# EAGLE design Vectr (EAGLE 6.3)

## Sheet 1 of 3: Analog
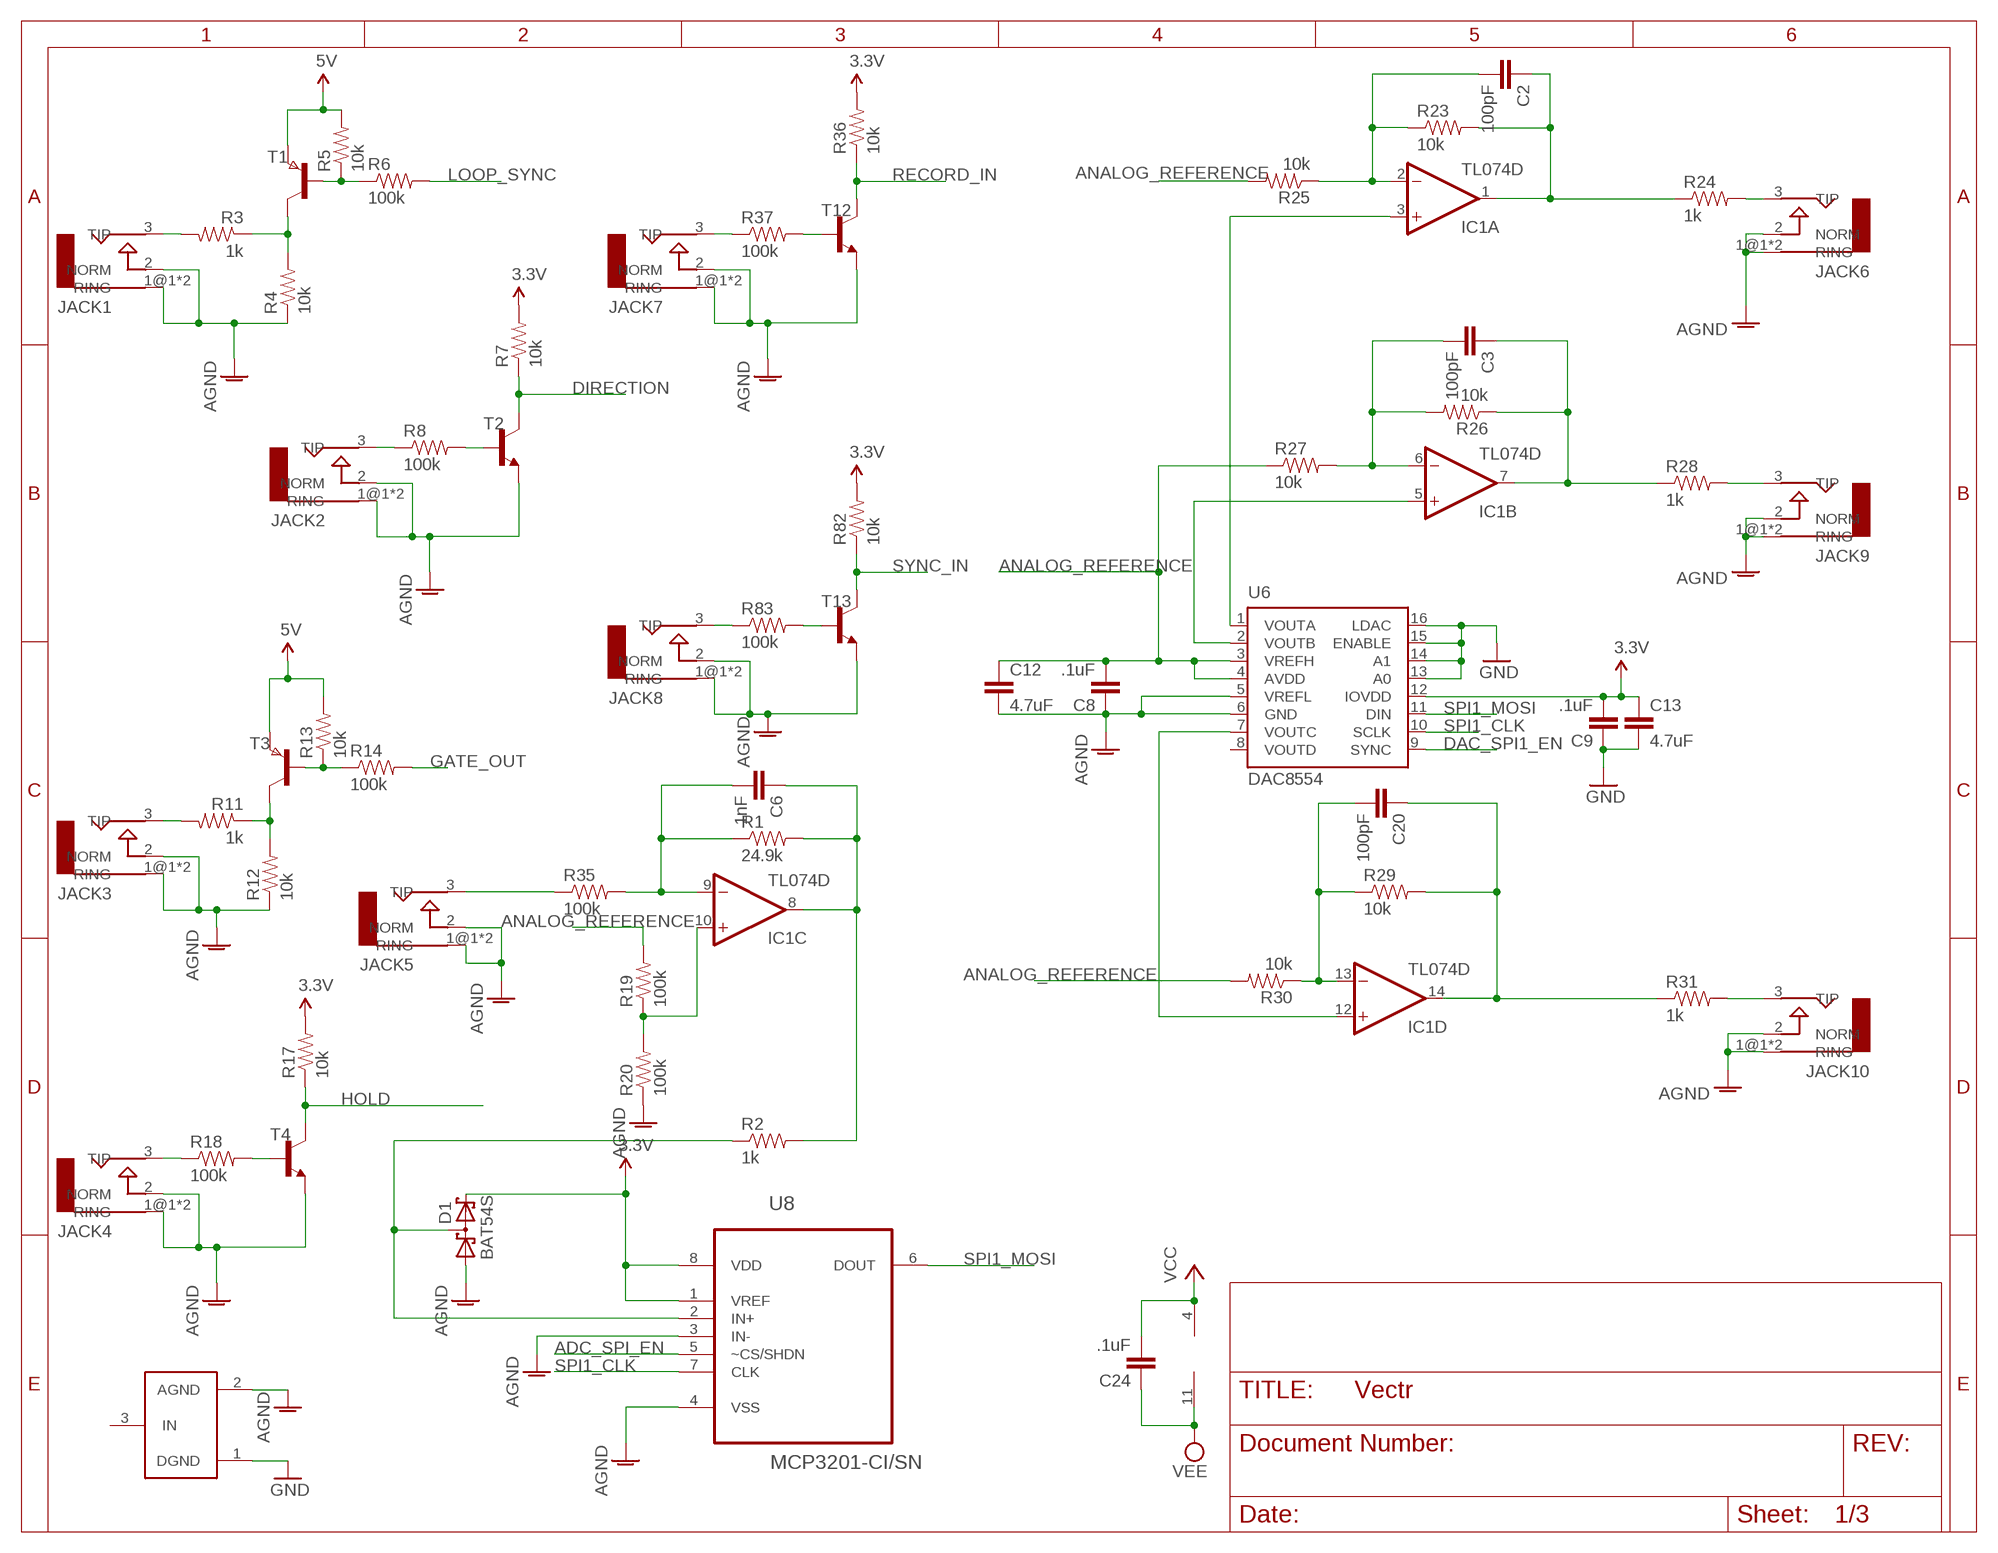
[diagram p0: schematic, sheet 1]

### Parts
C2  100pF  CAP0603-CAP  [0603-CAP]
C3  100pF  CAP0603-CAP  [0603-CAP]
C6  1nF  CAP0603-CAP  [0603-CAP]
C8  .1uF  CAP0603-CAP  [0603-CAP]
C9  .1uF  CAP0603-CAP  [0603-CAP]
C12  4.7uF  CAP1206  [1206]
C13  4.7uF  CAP1206  [1206]
C20  100pF  CAP0603-CAP  [0603-CAP]
C24  .1uF  CAP0603-CAP  [0603-CAP]
D1  BAT54S  [SOT23]
IC1  TL074D  [SO14]
JACK1  AUDIO-JACKERTHENVAR  [ERTHENVAR-JACK]
JACK2  AUDIO-JACKERTHENVAR  [ERTHENVAR-JACK]
JACK3  AUDIO-JACKERTHENVAR  [ERTHENVAR-JACK]
JACK4  AUDIO-JACKERTHENVAR  [ERTHENVAR-JACK]
JACK5  AUDIO-JACKERTHENVAR  [ERTHENVAR-JACK]
JACK6  AUDIO-JACKERTHENVAR  [ERTHENVAR-JACK]
JACK7  AUDIO-JACKERTHENVAR  [ERTHENVAR-JACK]
JACK8  AUDIO-JACKERTHENVAR  [ERTHENVAR-JACK]
JACK9  AUDIO-JACKERTHENVAR  [ERTHENVAR-JACK]
JACK10  AUDIO-JACKERTHENVAR  [ERTHENVAR-JACK]
R1  24.9k  RESISTOR0603-RES  [0603-RES]
R2  1k  RESISTOR0603-RES  [0603-RES]
R3  1k  RESISTOR0603-RES  [0603-RES]
R4  10k  RESISTOR0603-RES  [0603-RES]
R5  10k  RESISTOR0603-RES  [0603-RES]
R6  100k  RESISTOR0603-RES  [0603-RES]
R7  10k  RESISTOR0603-RES  [0603-RES]
R8  100k  RESISTOR0603-RES  [0603-RES]
R11  1k  RESISTOR0603-RES  [0603-RES]
R12  10k  RESISTOR0603-RES  [0603-RES]
R13  10k  RESISTOR0603-RES  [0603-RES]
R14  100k  RESISTOR0603-RES  [0603-RES]
R17  10k  RESISTOR0603-RES  [0603-RES]
R18  100k  RESISTOR0603-RES  [0603-RES]
R19  100k  RESISTOR0603-RES  [0603-RES]
R20  100k  RESISTOR0603-RES  [0603-RES]
R23  10k  RESISTOR0603-RES  [0603-RES]
R24  1k  RESISTOR0603-RES  [0603-RES]
R25  10k  RESISTOR0603-RES  [0603-RES]
R26  10k  RESISTOR0603-RES  [0603-RES]
R27  10k  RESISTOR0603-RES  [0603-RES]
R28  1k  RESISTOR0603-RES  [0603-RES]
R29  10k  RESISTOR0603-RES  [0603-RES]
R30  10k  RESISTOR0603-RES  [0603-RES]
R31  1k  RESISTOR0603-RES  [0603-RES]
R35  100k  RESISTOR0603-RES  [0603-RES]
R36  10k  RESISTOR0603-RES  [0603-RES]
R37  100k  RESISTOR0603-RES  [0603-RES]
R82  10k  RESISTOR0603-RES  [0603-RES]
R83  100k  RESISTOR0603-RES  [0603-RES]
T1  PNPSOT23  [SOT-23]
T2  -NPN-SOT23-EBC  [SOT23-EBC]
T3  PNPSOT23  [SOT-23]
T4  -NPN-SOT23-EBC  [SOT23-EBC]
T12  -NPN-SOT23-EBC  [SOT23-EBC]
T13  -NPN-SOT23-EBC  [SOT23-EBC]
U6  DAC8554  [PW_R-PDSO-G16]
U8  MCP3201-CI/SN  [SOIC127P600X175-8N]
U$11  GND_CONNECT  [GND_CONNECT]

### Nets
3.3V: C9.2 C13.1 D1.2(C2) R7.2 R17.2 R36.2 R82.2 U6.12(IOVDD) U8.1(VREF) U8.8(VDD) ; also sheet 2,3
5V: R5.2 R13.2 T1.2(E) T3.2(E) ; also sheet 2
ADC_SPI_EN: U8.5(~CS/SHDN) ; also sheet 3
AGND: C8.1 C12.2 D1.1(A1) JACK1.1@1(RING) JACK1.1@2(RING) JACK1.2(NORM) JACK2.1@1(RING) JACK2.1@2(RING) JACK2.2(NORM) JACK3.1@1(RING) JACK3.1@2(RING) JACK3.2(NORM) JACK4.1@1(RING) JACK4.1@2(RING) JACK4.2(NORM) JACK5.1@1(RING) JACK5.1@2(RING) JACK5.2(NORM) JACK6.1@1(RING) JACK6.1@2(RING) JACK6.2(NORM) JACK7.1@1(RING) JACK7.1@2(RING) JACK7.2(NORM) JACK8.1@1(RING) JACK8.1@2(RING) JACK8.2(NORM) JACK9.1@1(RING) JACK9.1@2(RING) JACK9.2(NORM) JACK10.1@1(RING) JACK10.1@2(RING) JACK10.2(NORM) R4.1 R12.1 R20.1 T2.E T4.E T12.E T13.E U6.5(VREFL) U6.6(GND) U8.3(IN-) U8.4(VSS) U$11.2(AGND) ; also sheet 2
ANALOG_REFERENCE: C8.2 C12.1 R19.2 R25.2 R27.1 R30.2 U6.3(VREFH) U6.4(AVDD) ; also sheet 2
DAC_SPI1_EN: U6.9(SYNC) ; also sheet 3
DIRECTION: R7.1 T2.C ; also sheet 3
GATE_OUT: R14.2 ; also sheet 3
GND: C9.1 C13.2 U6.13(A0) U6.14(A1) U6.15(ENABLE) U6.16(LDAC) U$11.1(DGND) ; also sheet 2,3
HOLD: R17.1 T4.C ; also sheet 3
LOOP_SYNC: R6.2 ; also sheet 3
N$1: R5.1 R6.1 T1.3(B)
N$2: C2.2 IC1.2(A:-IN) R23.1 R25.1
N$4: C2.1 IC1.1(A:OUT) R23.2 R24.1
N$5: R3.1 R4.2 T1.1(C)
N$6: JACK1.3(TIP) R3.2
N$7: IC1.5(B:+IN) U6.2(VOUTB)
N$8: JACK2.3(TIP) R8.1
N$9: R8.2 T2.B
N$11: C3.2 IC1.6(B:-IN) R26.2 R27.2
N$12: R13.1 R14.1 T3.3(B)
N$13: R11.1 R12.2 T3.1(C)
N$14: JACK3.3(TIP) R11.2
N$15: C3.1 IC1.7(B:OUT) R26.1 R28.1
N$16: R18.2 T4.B
N$18: JACK4.3(TIP) R18.1
N$19: C20.2 IC1.13(D:-IN) R29.1 R30.1
N$21: C20.1 IC1.14(D:OUT) R29.2 R31.1
N$22: C6.2 IC1.9(C:-IN) R1.1 R35.2
N$23: IC1.3(A:+IN) U6.1(VOUTA)
N$24: D1.3(C1A2) R2.1 U8.2(IN+)
N$25: JACK6.3(TIP) R24.2
N$26: JACK5.3(TIP) R35.1
N$27: C6.1 IC1.8(C:OUT) R1.2 R2.2
N$28: IC1.10(C:+IN) R19.1 R20.2
N$30: JACK7.3(TIP) R37.1
N$31: JACK9.3(TIP) R28.2
N$32: R37.2 T12.B
N$34: IC1.12(D:+IN) U6.7(VOUTC)
N$38: JACK10.3(TIP) R31.2
N$39: JACK8.3(TIP) R83.1
N$40: R83.2 T13.B
RECORD_IN: R36.1 T12.C ; also sheet 3
SPI1_CLK: U6.10(SCLK) U8.7(CLK) ; also sheet 3
SPI1_MOSI: U6.11(DIN) U8.6(DOUT) ; also sheet 3
SYNC_IN: R82.1 T13.C ; also sheet 3
VCC: C24.2 IC1.4(P:V+) ; also sheet 2
VEE: C24.1 IC1.11(P:V-) ; also sheet 2
Unconnected: U6.8(VOUTD) U$11.3(IN)

## Sheet 2 of 3: Power
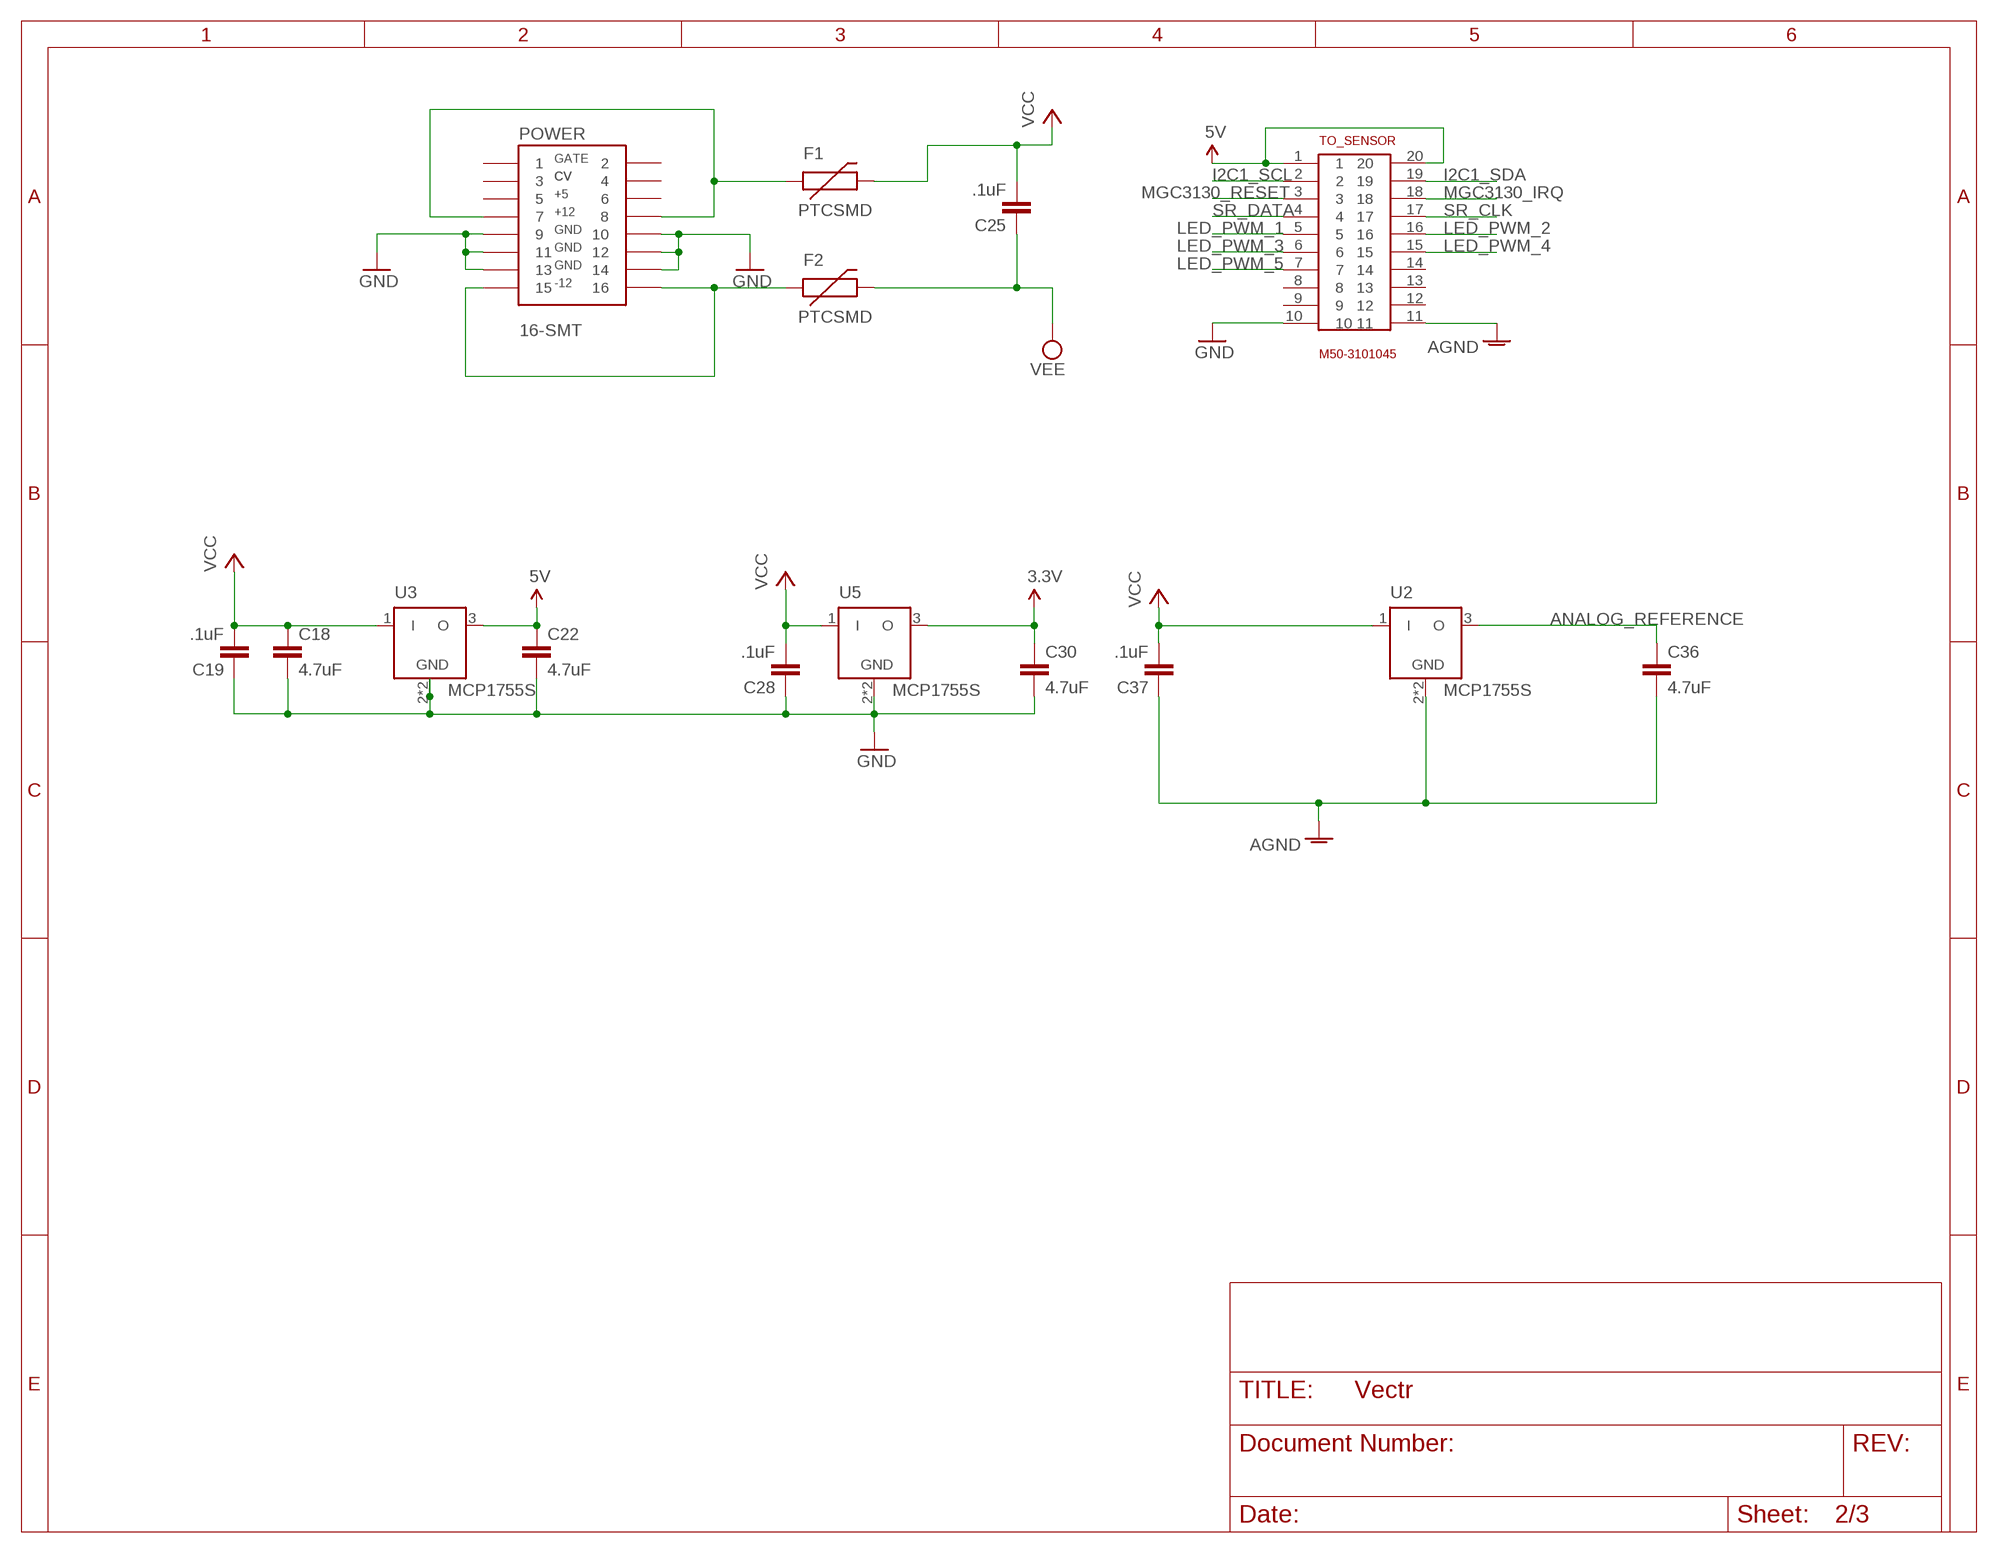
[diagram p1: schematic, sheet 2]

### Parts
C18  4.7uF  CAP1206  [1206]
C19  .1uF  CAP0603-CAP  [0603-CAP]
C22  4.7uF  CAP1206  [1206]
C25  .1uF  CAP0603-CAP  [0603-CAP]
C28  .1uF  CAP0603-CAP  [0603-CAP]
C30  4.7uF  CAP1206  [1206]
C36  4.7uF  CAP1206  [1206]
C37  .1uF  CAP0603-CAP  [0603-CAP]
F1  PTCSMD  [PTC-1206]
F2  PTCSMD  [PTC-1206]
POWER  16-SMT  [16-SMT]
TO_SENSOR  M50-3101045  [M50-3101045]
U2  MCP1755S  [SOT223]
U3  MCP1755S  [SOT223]
U5  MCP1755S  [SOT223]

### Nets
3.3V: C30.1 U5.3(O) ; also sheet 1,3
5V: C22.1 TO_SENSOR.1 TO_SENSOR.20 U3.3(O) ; also sheet 1
AGND: C36.2 C37.1 TO_SENSOR.11 U2.2(GND) U2.4(GND) ; also sheet 1
ANALOG_REFERENCE: C36.1 U2.3(O) ; also sheet 1
GND: C18.2 C19.1 C22.2 C28.1 C30.2 POWER.P$9 POWER.P$10 POWER.P$11 POWER.P$12 POWER.P$13 POWER.P$14 TO_SENSOR.10 U3.2(GND) U3.4(GND) U5.2(GND) U5.4(GND) ; also sheet 1,3
I2C1_SCL: TO_SENSOR.2 ; also sheet 3
I2C1_SDA: TO_SENSOR.19 ; also sheet 3
LED_PWM_1: TO_SENSOR.5 ; also sheet 3
LED_PWM_2: TO_SENSOR.16 ; also sheet 3
LED_PWM_3: TO_SENSOR.6 ; also sheet 3
LED_PWM_4: TO_SENSOR.15 ; also sheet 3
LED_PWM_5: TO_SENSOR.7 ; also sheet 3
MGC3130_IRQ: TO_SENSOR.18 ; also sheet 3
MGC3130_RESET: TO_SENSOR.3 ; also sheet 3
N$42: F1.1 POWER.P$7 POWER.P$8
N$44: F2.1 POWER.P$15 POWER.P$16
SR_CLK: TO_SENSOR.17 ; also sheet 3
SR_DATA: TO_SENSOR.4 ; also sheet 3
VCC: C18.1 C19.2 C25.2 C28.2 C37.2 F1.2 U2.1(I) U3.1(I) U5.1(I) ; also sheet 1
VEE: C25.1 F2.2 ; also sheet 1
Unconnected: POWER.P$1 POWER.P$2 POWER.P$3 POWER.P$4 POWER.P$5 POWER.P$6 TO_SENSOR.8 TO_SENSOR.9 TO_SENSOR.12 TO_SENSOR.13 TO_SENSOR.14

## Sheet 3 of 3: PIC32
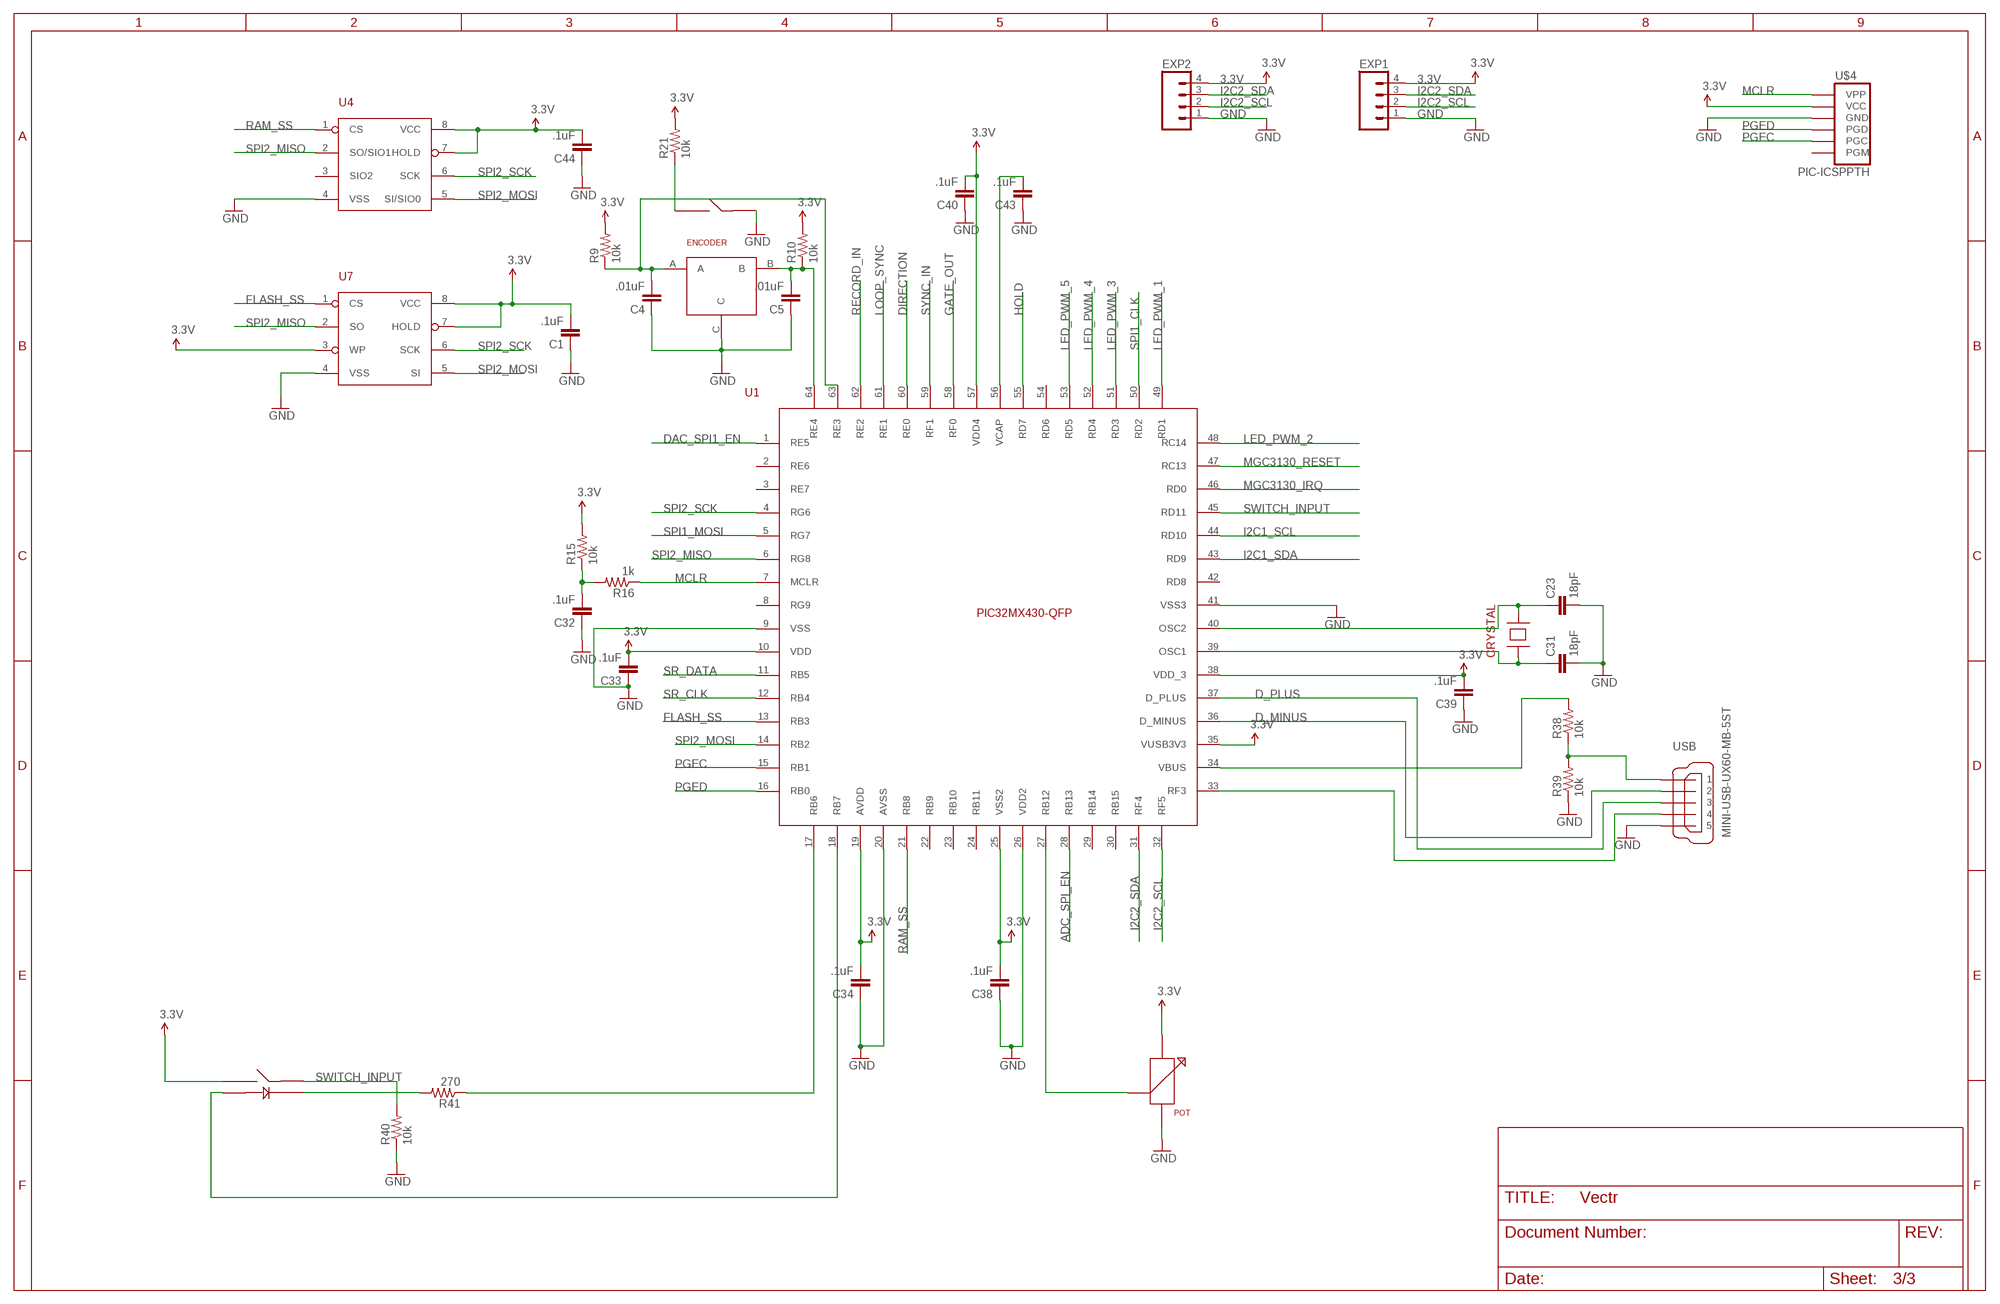
[diagram p2: schematic, sheet 3]

### Parts
C1  .1uF  CAP0603-CAP  [0603-CAP]
C4  .01uF  CAP0603-CAP  [0603-CAP]
C5  .01uF  CAP0603-CAP  [0603-CAP]
C23  18pF  CAP0603-CAP  [0603-CAP]
C31  18pF  CAP0603-CAP  [0603-CAP]
C32  .1uF  CAP0603-CAP  [0603-CAP]
C33  .1uF  CAP0603-CAP  [0603-CAP]
C34  .1uF  CAP0603-CAP  [0603-CAP]
C38  .1uF  CAP0603-CAP  [0603-CAP]
C39  .1uF  CAP0603-CAP  [0603-CAP]
C40  .1uF  CAP0603-CAP  [0603-CAP]
C43  .1uF  CAP0603-CAP  [0603-CAP]
C44  .1uF  CAP0603-CAP  [0603-CAP]
CRYSTAL  SMD-4-CRYSTAL  [SMD-4-CRYSTAL]
ENCODER  PEC16_ENCODER  [PEC16_ENCODER]
EXP1  M04SMD_STRAIGHT_COMBO  [1X04_SMD_STRAIGHT_COMBO]
EXP2  M04SMD_STRAIGHT_COMBO  [1X04_SMD_STRAIGHT_COMBO]
POT  9MMPOT  [9MMPOT]
R9  10k  RESISTOR0603-RES  [0603-RES]
R10  10k  RESISTOR0603-RES  [0603-RES]
R15  10k  RESISTOR0603-RES  [0603-RES]
R16  1k  RESISTOR0603-RES  [0603-RES]
R21  10k  RESISTOR0603-RES  [0603-RES]
R38  10k  RESISTOR0603-RES  [0603-RES]
R39  10k  RESISTOR0603-RES  [0603-RES]
R40  10k  RESISTOR0603-RES  [0603-RES]
R41  270  RESISTOR0603-RES  [0603-RES]
U1  PIC32MX430-QFP  [QFP50P1200X1200X120-64N]
U4  23LC512  [SO-08]
U7  SST25VF010A  [SO-08]
U$2  5GSH9  [5GSH9]
U$4  PIC-ICSPPTH  [MOLEX-1X6]
USB  MINI-USB-UX60-MB-5ST  [UX60-MB-5ST]

### Nets
3.3V: C1.2 C33.2 C34.2 C38.2 C39.2 C40.2 C44.2 EXP1.4 EXP2.4 POT.1 R9.2 R10.2 R15.2 R21.2 U1.10(VDD) U1.19(AVDD) U1.25(VSS2) U1.35(VUSB3V3) U1.38(VDD_3) U1.57(VDD4) U4.7(HOLD) U4.8(VCC) U7.3(WP) U7.7(HOLD) U7.8(VCC) U$2.1 U$4.5(VCC) ; also sheet 1,2
ADC_SPI_EN: U1.28(RB13) ; also sheet 1
D_MINUS: U1.36(D_MINUS) USB.2
D_PLUS: U1.37(D_PLUS) USB.3
DAC_SPI1_EN: U1.1(RE5) ; also sheet 1
DIRECTION: U1.60(RE0) ; also sheet 1
FLASH_SS: U1.13(RB3) U7.1(CS)
GATE_OUT: U1.58(RF0) ; also sheet 1
GND: C1.1 C4.1 C5.1 C23.2 C31.2 C32.1 C33.1 C34.1 C38.1 C39.1 C40.1 C43.1 C44.1 ENCODER.C ENCODER.E EXP1.1 EXP2.1 POT.3 R39.1 R40.1 U1.9(VSS) U1.20(AVSS) U1.26(VDD2) U1.41(VSS3) U4.4(VSS) U7.4(VSS) U$4.4(GND) USB.5 ; also sheet 1,2
HOLD: U1.55(RD7) ; also sheet 1
I2C1_SCL: U1.44(RD10) ; also sheet 2
I2C1_SDA: U1.43(RD9) ; also sheet 2
I2C2_SCL: EXP1.2 EXP2.2 U1.32(RF5)
I2C2_SDA: EXP1.3 EXP2.3 U1.31(RF4)
LED_PWM_1: U1.49(RD1) ; also sheet 2
LED_PWM_2: U1.48(RC14) ; also sheet 2
LED_PWM_3: U1.51(RD3) ; also sheet 2
LED_PWM_4: U1.52(RD4) ; also sheet 2
LED_PWM_5: U1.53(RD5) ; also sheet 2
LOOP_SYNC: U1.61(RE1) ; also sheet 1
MCLR: R16.1 U1.7(MCLR) U$4.6(VPP)
MGC3130_IRQ: U1.46(RD0) ; also sheet 2
MGC3130_RESET: U1.47(RC13) ; also sheet 2
N$17: C32.2 R15.1 R16.2
N$20: C5.2 ENCODER.B R10.1 U1.64(RE4)
N$29: C4.2 ENCODER.A R9.1 U1.63(RE3)
N$33: POT.2 U1.27(RB12)
N$35: U1.18(RB7) U$2.3
N$37: ENCODER.D R21.1
N$41: C23.1 CRYSTAL.3 U1.40(OSC2)
N$43: C31.1 CRYSTAL.1 U1.39(OSC1)
N$45: R38.1 R39.2 USB.1
N$46: C43.2 U1.56(VCAP)
N$47: R38.2 U1.34(VBUS)
N$50: U1.33(RF3) USB.4
N$51: R41.2 U$2.2
PGEC: U1.15(RB1) U$4.2(PGC)
PGED: U1.16(RB0) U$4.3(PGD)
RAM_SS: U1.21(RB8) U4.1(CS)
RECORD_IN: U1.62(RE2) ; also sheet 1
SPI1_CLK: U1.50(RD2) ; also sheet 1
SPI1_MOSI: U1.5(RG7) ; also sheet 1
SPI2_MISO: U1.6(RG8) U4.2(SO/SIO1) U7.2(SO)
SPI2_MOSI: U1.14(RB2) U4.5(SI/SIO0) U7.5(SI)
SPI2_SCK: U1.4(RG6) U4.6(SCK) U7.6(SCK)
SR_CLK: U1.12(RB4) ; also sheet 2
SR_DATA: U1.11(RB5) ; also sheet 2
SWITCH_INPUT: R40.2 U1.45(RD11) U$2.4
SWITCH_LED1: R41.1 U1.17(RB6)
SYNC_IN: U1.59(RF1) ; also sheet 1
Unconnected: U1.2(RE6) U1.3(RE7) U1.8(RG9) U1.22(RB9) U1.23(RB10) U1.24(RB11) U1.29(RB14) U1.30(RB15) U1.42(RD8) U1.54(RD6) U4.3(SIO2) U$4.1(PGM)

## Library data of the parts
C1-C6 C8 C9 C19 C20 C23-C25 C28 C31-C34 C37-C40 C43 C44 = SparkFun-Passives:CAP: Capacitor Standard 0603 ceramic capacitor, and 0.1" leaded capacitor.
C12 C13 C18 C22 C30 C36 = SparkFun-Capacitors:CAP: Capacitor Standard 0603 ceramic capacitor, and 0.1" leaded capacitor.
CRYSTAL = HackMe:SMD-4-CRYSTAL
D1 = diode:BAT54S: Schottky Diodes Pin connection corrected 2011-05-04 Source: Fairchild .. BAT54.pdf
ENCODER = HackMe:PEC16_ENCODER
EXP1 EXP2 = SparkFun-Connectors:M04: Header 4 Standard 4-pin 0.1" header. Use with straight break away headers (SKU : PRT-00116), right angle break away headers (PRT-00553), swiss pins (PRT-00743), machine pins (PRT-00117), and female headers (PRT-00115). Molex polarized connector foot print use with SKU : PRT-08231 with associated crimp pins and housings. 1MM SMD Version SKU: PRT-10208
F1 F2 = SparkFun-PowerIC:PTC: Resettable Fuse PTC Resettable Fuse. Spark Fun Electronics SKU : COM-08357
IC1 = linear:TL074: OP AMP
JACK1-JACK10 = erthenvar:AUDIO-JACK: Switching Mono 3.5mm Audio Jack from Erthenvar.
POT = HackMe:9MMPOT
POWER = HackMe:16-SMT
R1-R21 R23-R31 R35-R41 R82 R83 = SparkFun-Passives:RESISTOR: Resistor Basic schematic elements and footprints for 0603, 1206, and PTH resistors.
T1 T3 = zetex:PNPSOT23: PNP TRANSISTOR; MPN: DSS20200L-7; OC_FARNELL: unknown; OC_NEWARK: 25R4554
T2 T4 T12 T13 = transistor:*-NPN-: NPN Transistror BF959 corrected 2008.03.06
TO_SENSOR = HackMe:M50-3101045
U1 = HackMe:PIC32MX430-QFP
U2 U3 U5 = HackMe:MCP1755S
U4 = HackMe:23LC512: SPI SRAM 512kbit
U6 = HackMe:DAC8554: 16 bit 4 channel DAC
U7 = HackMe:SST25VF010A
U8 = Microchip_By_element14_Batch_1:MCP3201-CI/SN: 12Bit A/D Converter; MPN: MCP3201-CI/SN; OC_FARNELL: 3167240; OC_NEWARK: 73K1001; PACKAGE: SOIC-8; SUPPLIER: Microchip
U$2 = HackMe:5GSH9
U$4 = SparkFun-Connectors:PIC-ICSP: ISCP Programming connector for UAV, UBW Kit, etc.
U$11 = SparkFun-Passives:GND_CONNECT: Use to make a connection of multiple grounds in only one place.
USB = con-hirose:MINI-USB-: MINI USB Connector Source: http://www.hirose.co.jp/cataloge_hp/e24000019.pdf; OC_FARNELL: unknown; OC_NEWARK: unknown

## Board
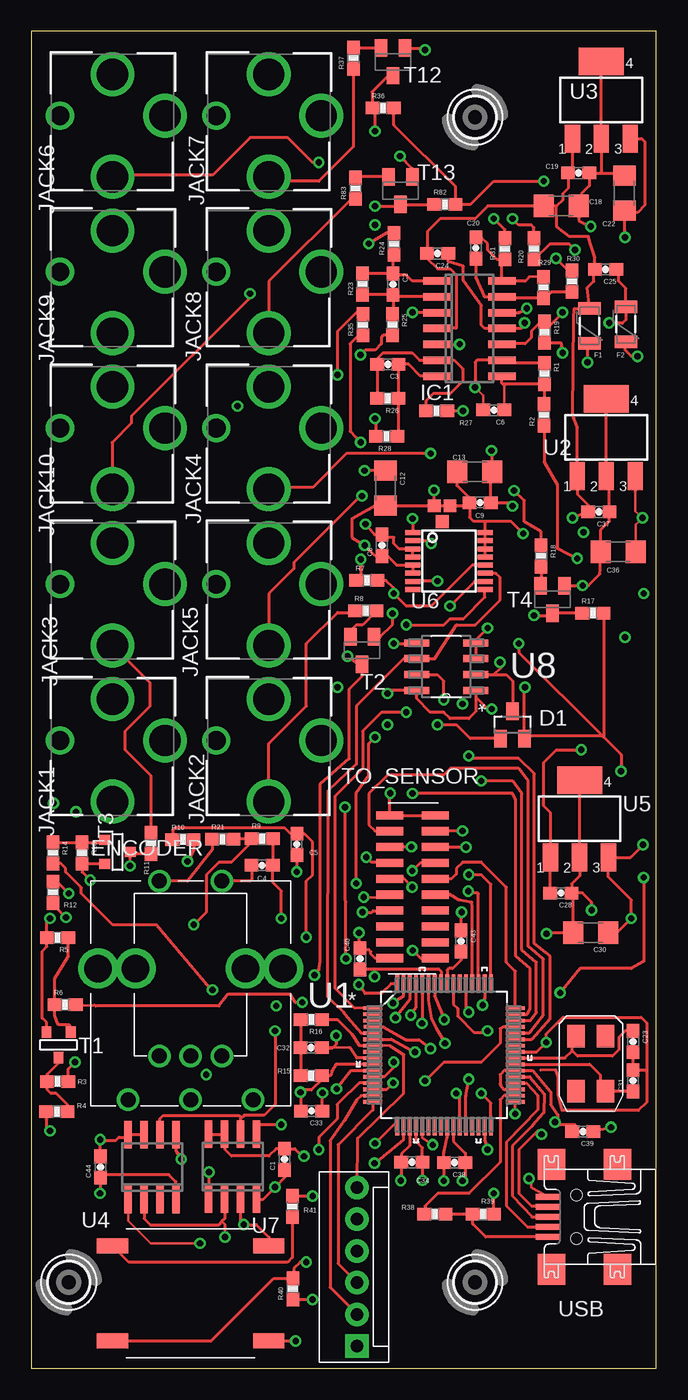
[diagram p3: board, top side]
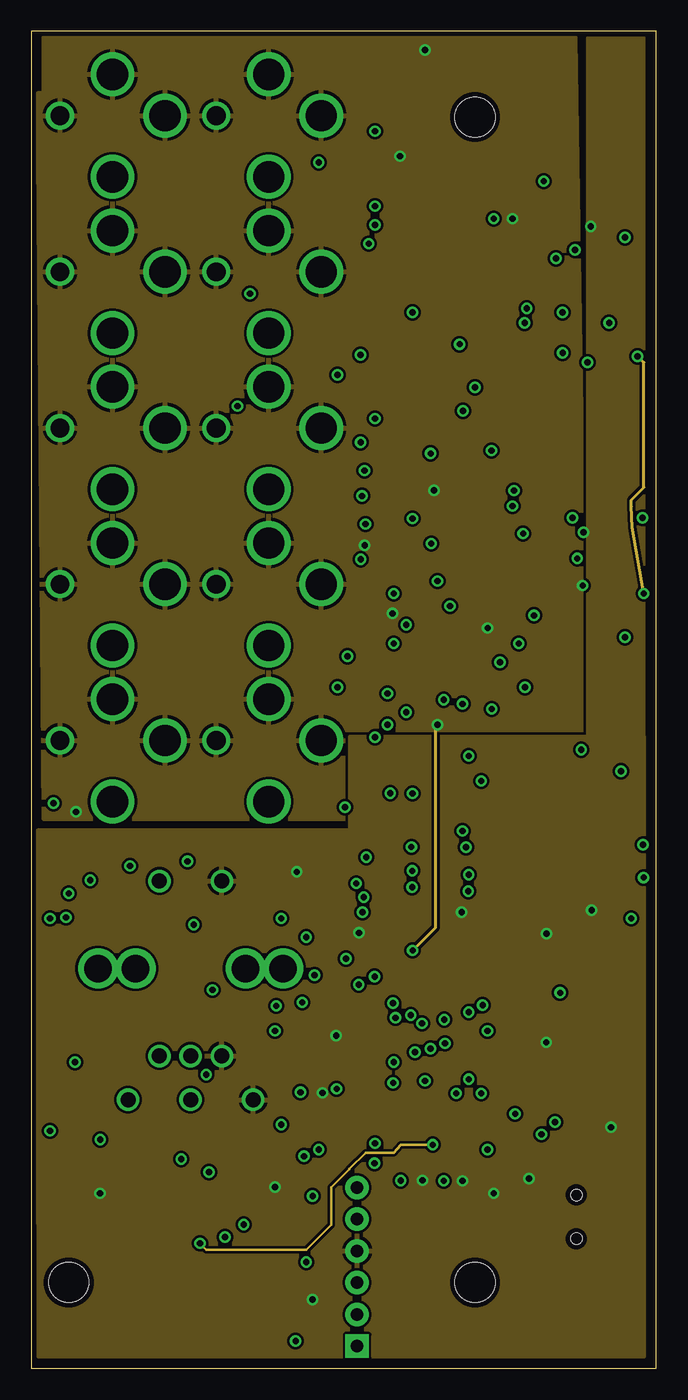
[diagram p4: board, inner layer Route2]
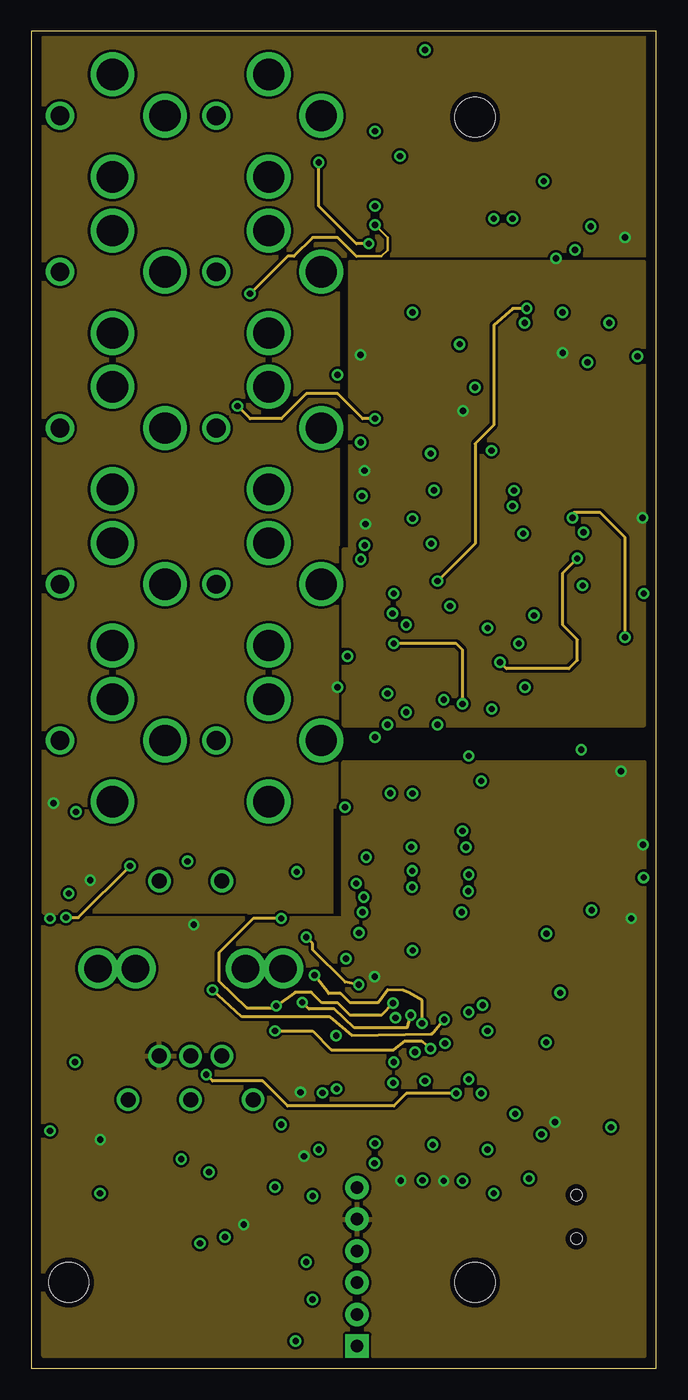
[diagram p5: board, inner layer Route15]
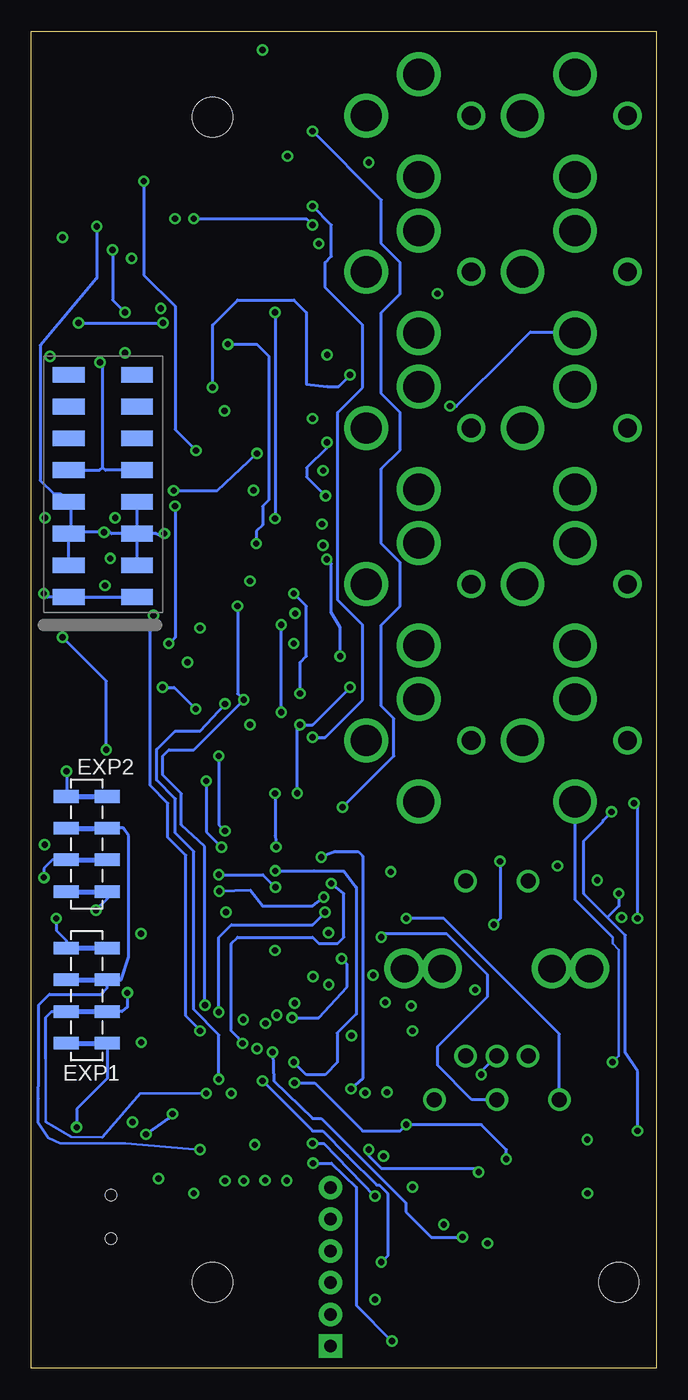
[diagram p6: board, bottom side, seen from below]

Size 50 x 107 mm. Coordinates in mm from the lower left corner, seen from the top.
Outline: 0,0 50,0 50,107 0,107 0,0
Copper layers (1*2+15*16): Top 0.035mm / dielectric 1.5mm / Route2 0.035mm / dielectric 0.15mm / Route15 0.035mm / dielectric 0.2mm / Bottom 0.035mm
Design rules "default *": minimum track width 8mil, minimum drill 15mil, track to track 8mil, track to pad 8mil, pad to pad 8mil, via to via 8mil, smd to smd 8mil, copper to edge 15mil, drill to drill 8mil, minimum pad ring 10mil, minimum via ring 8mil, stop-mask expansion 4mil, vias tented up to drill 0mil, thermal gap 10mil

### Footprints (pad centres in the part's own frame; a part is rotated, then mirrored left to right if it is on the bottom)
0603-CAP = smd 1.1 x 1: 1 -0.85,0; 2 0.85,0
1206 = smd 1.6 x 1.8: 1 -1.4,0; 2 1.4,0
SMD-4-CRYSTAL = smd 1.803 x 1.397: 1 -2.197,-1.194; 2 2.197,-1.194; 3 2.197,1.194; 4 -2.197,1.194
SOT23 = smd 1 x 1.4: 1 -0.95,-1.1; 2 0.95,-1.1; 3 0,1.1
PEC16_ENCODER = drill 1.2: A -5,-10.5; B 0,-10.5; C 5,-10.5; D -2.5,7; E 2.5,7 | drill 2.2: P$6 -7.4,0; P$7 7.4,0
1X04_SMD_STRAIGHT_COMBO = smd 1 x 2: 1 0,-1.65; 1-2 0,1.65; 2 2.54,1.65; 2-2 2.54,-1.65; 3 5.08,-1.65; 3-2 5.08,1.65; 4 7.62,1.65; 4-2 7.62,-1.65
PTC-1206 = smd 1 x 1.8: 1 -1.4,0; 2 1.4,0
SO14 = smd 0.6 x 2.2: 1 -3.81,-2.6; 2 -2.54,-2.6; 3 -1.27,-2.6; 4 0,-2.6; 5 1.27,-2.6; 6 2.54,-2.6; 7 3.81,-2.6; 8 3.81,2.6; 9 2.54,2.6; 10 1.27,2.6; 11 0,2.6; 12 -1.27,2.6; 13 -2.54,2.6; 14 -3.81,2.6
ERTHENVAR-JACK = drill 2.5: 1@1 -4.2,0; 2 0,-3.3; 3 0,4.9 | drill 1.5: 1@2 4.2,0
9MMPOT = drill 1.2: 1 -2.5,-7; 2 0,-7; 3 2.5,-7 | drill 2.2: P$4 -4.4,0; P$5 4.4,0
16-SMT = smd 1.27 x 2.54: P$1 0,0; P$2 0,5.46; P$3 2.54,0; P$4 2.54,5.46; P$5 5.08,0; P$6 5.08,5.46; P$7 7.62,0; P$8 7.62,5.46; P$9 10.16,0; P$10 10.16,5.46; P$11 12.7,0; P$12 12.7,5.46; P$13 15.24,0; P$14 15.24,5.46; P$15 17.78,0; P$16 17.78,5.46
0603-RES = smd 1.1 x 1: 1 -0.85,0; 2 0.85,0
SOT-23 = smd 0.787 x 0.889: 1 0.025,-1.016; 2 -0.94,1.016; 3 0.991,1.016
SOT23-EBC = smd 1 x 1.4: B 0.95,-1.1; C 0,1.1; E -0.95,-1.1
M50-3101045 = smd 0.65 x 2.15: 1 0,-1.825; 2 1.27,-1.825; 3 2.54,-1.825; 4 3.81,-1.825; 5 5.08,-1.825; 6 6.35,-1.825; 7 7.62,-1.825; 8 8.89,-1.825; 9 10.16,-1.825; 10 11.43,-1.825; 11 11.43,1.825; 12 10.16,1.825; 13 8.89,1.825; 14 7.62,1.825; 15 6.35,1.825; 16 5.08,1.825; 17 3.81,1.825; 18 2.54,1.825; 19 1.27,1.825; 20 0,1.825
QFP50P1200X1200X120-64N = smd 1.5 x 0.3: 1 -5.7,3.75; 2 -5.7,3.25; 3 -5.7,2.75; 5 -5.7,1.75; 6 -5.7,1.25; 7 -5.7,0.75; 8 -5.7,0.25; 9 -5.7,-0.25; 10 -5.7,-0.75; 11 -5.7,-1.25; 12 -5.7,-1.75; 13 -5.7,-2.25; 14 -5.7,-2.75; 15 -5.7,-3.25; 16 -5.7,-3.75; 33 5.7,-3.75; 34 5.7,-3.25; 35 5.7,-2.75; 36 5.7,-2.25; 37 5.7,-1.75; 38 5.7,-1.25; 39 5.7,-0.75; 40 5.7,-0.25; 41 5.7,0.25; 42 5.7,0.75; 43 5.7,1.25; 44 5.7,1.75; 45 5.7,2.25; 46 5.7,2.75; 47 5.7,3.25; 48 5.7,3.75 | smd 1.473 x 0.279: 4 -5.7,2.25 | smd 0.3 x 1.5: 17 -3.75,-5.7; 18 -3.25,-5.7; 19 -2.75,-5.7; 20 -2.25,-5.7; 21 -1.75,-5.7; 22 -1.25,-5.7; 23 -0.75,-5.7; 24 -0.25,-5.7; 25 0.25,-5.7; 26 0.75,-5.7; 27 1.25,-5.7; 28 1.75,-5.7; 29 2.25,-5.7; 30 2.75,-5.7; 31 3.25,-5.7; 32 3.75,-5.7; 49 3.75,5.7; 50 3.25,5.7; 51 2.75,5.7; 52 2.25,5.7; 53 1.75,5.7; 54 1.25,5.7; 56 0.25,5.7; 57 -0.25,5.7; 58 -0.75,5.7; 59 -1.25,5.7; 60 -1.75,5.7; 61 -2.25,5.7; 62 -2.75,5.7; 63 -3.25,5.7; 64 -3.75,5.7 | smd 0.279 x 1.473: 55 0.75,5.7
SOT223 = smd 1.219 x 2.235: 1 -2.311,-3.099; 2 0,-3.099; 3 2.311,-3.099 | smd 3.6 x 2.2: 4 0,3.099
SO-08 = smd 0.6 x 2.2: 1 -1.905,-2.6; 2 -0.635,-2.6; 3 0.635,-2.6; 4 1.905,-2.6; 5 1.905,2.6; 6 0.635,2.6; 7 -0.635,2.6; 8 -1.905,2.6
PW_R-PDSO-G16 = smd 0.4 x 1.2: 1 -2.275,-2.9; 2 -1.625,-2.9; 3 -0.975,-2.9; 4 -0.325,-2.9; 5 0.325,-2.9; 6 0.975,-2.9; 7 1.625,-2.9; 8 2.275,-2.9; 9 2.275,2.9; 10 1.625,2.9; 11 0.975,2.9; 12 0.325,2.9; 13 -0.325,2.9; 14 -0.975,2.9; 15 -1.625,2.9; 16 -2.275,2.9
SOIC127P600X175-8N = smd 1.981 x 0.559: 1 -2.362,1.905; 2 -2.362,0.635; 3 -2.362,-0.635; 4 -2.362,-1.905; 5 2.362,-1.905; 6 2.362,-0.635; 7 2.362,0.635; 8 2.362,1.905
3,2 = hole 3.2: 0,0
5GSH9 = smd 2.5 x 1.2: 1 6.25,3.81; 2 -6.25,3.81; 3 6.25,-3.81; 4 -6.25,-3.81
MOLEX-1X6 = drill 1.016 pad 1.88 square: 1 0,0 | drill 1.016 pad 1.88: 2 2.54,0; 3 5.08,0; 4 7.62,0; 5 10.16,0; 6 12.7,0
GND_CONNECT = smd 1.016 x 1.016: 1 -1.016,0; 2 -1.016,-1.27; 3 0.254,-0.635
UX60-MB-5ST = smd 2 x 0.5: 1 2.25,1.6; 2 2.25,0.8; 3 2.25,0; 4 2.25,-0.8; 5 2.25,-1.6 | smd 2.2 x 2.5: M1 -3.3,-4.2; M2 -3.3,4.2; M3 2,4.2; M4 2,-4.2 | hole 0.9: 0,-1.75; 0,1.75

### Placement (x,y rotation side)
C1  20.27,16.73 90 top
C2  28.95,86.75 270 top
C3  28.52,80.35 180 top
C4  18.47,40.24 0 top
C5  21.24,41.93 90 top
C6  37,76.68 180 top
C8  28.05,65.86 90 top
C9  35.91,69.28 0 top
C12  28.35,70.44 270 top
C13  35.47,71.75 180 top
C18  42.4,93.01 0 top
C19  43.79,95.65 180 top
C20  35.56,89.65 270 top
C22  47.44,94.04 90 top
C23  48.15,26.15 270 top
C24  32.5,89.21 180 top
C25  45.94,87.94 180 top
C28  42.37,38.04 180 top
C30  44.74,34.85 180 top
C31  48.14,23.02 90 top
C32  22.39,25.66 180 top
C33  22.43,20.6 180 top
C34  30.44,16.49 180 top
C36  46.97,65.35 180 top
C37  45.4,68.53 180 top
C38  33.86,16.46 180 top
C39  44.12,18.95 180 top
C40  26.31,32.77 270 top
C43  34.39,34.2 270 top
C44  5.54,16.12 90 top
CRYSTAL  44.76,24.37 90 top
D1  38.5,51.5 0 top
ENCODER  12.75,32 0 top
EXP1  45.57,26.01 90 bottom
EXP2  45.57,38.14 90 bottom
F1  44.66,83.41 90 top
F2  47.57,83.55 90 top
IC1  35.04,83.21 270 top
JACK1  6.5,50.25 180 top
JACK2  19,50.25 180 top
JACK3  6.5,62.75 180 top
JACK4  19,75.25 180 top
JACK5  19,62.75 180 top
JACK6  6.5,100.25 180 top
JACK7  19,100.25 180 top
JACK8  19,87.75 180 top
JACK9  6.5,87.75 180 top
JACK10  6.5,75.25 180 top
POT  12.75,32 0 top
POWER  47,79.5 270 bottom
R1  41.05,79.6 270 top
R2  41.03,76.3 90 top
R3  2.11,22.96 0 top
R4  2.05,20.55 0 top
R5  2.1,34.47 180 top
R6  2.71,29.1 0 top
R7  26.85,63.06 0 top
R8  26.76,60.63 0 top
R9  18.48,42.37 180 top
R10  12.13,42.32 0 top
R11  9.59,42.02 90 top
R12  1.73,38.1 270 top
R13  4.06,41.24 270 top
R14  1.73,41.25 270 top
R15  22.4,23.42 0 top
R16  22.41,27.92 180 top
R17  44.93,60.44 0 top
R18  40.79,65.02 270 top
R19  41.07,82.92 270 top
R20  40.21,89.6 270 top
R21  15.31,42.35 0 top
R23  26.51,86.77 90 top
R24  29.01,89.98 90 top
R25  28.9,83.52 270 top
R26  28.52,77.61 180 top
R27  32.42,76.63 180 top
R28  28.43,74.57 180 top
R29  40.99,86.49 90 top
R30  43.27,86.99 90 top
R31  37.88,89.59 90 top
R35  26.52,83.51 90 top
R36  28.14,100.86 0 top
R37  25.77,104.85 90 top
R38  32.28,12.34 180 top
R39  36.16,12.33 180 top
R40  20.92,6.36 90 top
R41  20.88,12.95 270 top
R82  33.09,93.15 0 top
R83  25.95,94.43 90 top
T1  2.16,25.88 0 top
T2  26.47,57.46 180 top
T3  6.9,41.29 90 top
T4  41.7,61.54 180 top
T12  28.94,104.54 180 top
T13  29.54,94.24 180 top
TO_SENSOR  30.5,44.25 270 top
U1  33.02,25.08 0 top
U2  46,74.5 0 top
U3  45.61,101.5 0 top
U4  9.66,16.11 0 top
U5  43.86,43.98 0 top
U6  33.41,64.6 270 top
U7  16.1,16.13 0 top
U8  33.2,56.15 180 top
U$1  [3,2]  3,6.88 0 top
U$2  12.75,6 0 top
U$3  [3,2]  35.5,100.12 0 top
U$4  26.07,1.77 90 top
U$5  [3,2]  35.5,6.88 0 top
U$11  33.51,68.01 270 top
USB  43.6,12.12 180 top

### Tracks (layer width: path | path; a pad name or v marks a point on that pad's centre or on a via)
3.3V  (via drill 0.5)
  Top 0.254: v33,15 v33.01,15.01 C38.2 33.01,17.25 33.28,18.54 33.27,19.84 U1.25 | U1.19 30.27,17.82 29.6,17.15 C34.2 29.59,15.07 29.56,15.04 v29.56,15.02 | 42.25,19.5 43.51,19.5 C39.2 | 42.25,19.5 42.1,19.4 v41.9,19.7 | C30.1 46.85,34.85 v48,36 48,37.48 46.17,39.31 U5.3 47.94,40.88 48.95,41.89 v48.94,41.9 v48.93,41.9 | 45.7,50.59 45.78,50.51 | 45.78,50.51 47.18,49.11 v47.18,47.79 | 45.7,50.59 39.64,50.59 D1.2 39.45,54.45 v39.5,54.5 | U8.1 35.56,53.72 | 35.56,53.72 35.56,52.56 35,52 33.5,52 33,52.5 31.93,52.5 30.84,53.59 U8.8 28.75,54.24 v28.5,54 | v36.84,52.76 36.52,52.76 35.56,53.72 | U1.10 24.37,24.34 24.02,23.77 24,23.51 23.9,23.41 R15.2 | R15.2 | R15.2 23.26,23.13 22.41,22.28 21.73,22.28 v21.54,22.09 21.54,20.64 C33.2 | U7.3 16.73,11.77 v17,11.5 18,11.5 19,10.5 U$2.1 | U7.8 U7.7 15.5,18.7 15.5,17.5 16,17 19,17 19.58,17.58 C1.2 21.08,17.58 21.65,17.01 21.51,17.01 21.5,17 21.73,17 21.78,16.95 21.8,16.97 v21.82,16.97 | C44.2 5.54,18.26 | 5.54,18.26 5.52,18.28 v5.52,18.3 | 5.54,18.26 6.76,18.26 7,18.5 7.54,18.5 U4.8 U4.7 | R21.2 16.27,42.37 R9.2 17.63,42.13 16,40.5 15,40.5 14,39.5 14,36.5 v13,35.5 | R10.2 12.99,41.49 v12.5,40.57 | R7.2 28.37,63.06 29,62.43 v29,62 30,61 32,61 35.27,64.28 U6.12 | R17.2 45.78,50.51 | v38.5,69 38.22,69.28 C9.2 36.76,71.64 C13.1 36.82,71.8 v36.82,73.44 | v39,58 39,57.29 45.7,50.59 | v41,95 37,95 35.15,93.15 R82.2 33.94,94.56 29,99.5 R36.2 | 42.25,19.5 42.13,19.62 42.13,20.3 41.55,21.12 41.55,22.12 40.1,23.83 U1.38 37.83,23.83 37.5,23.5 37.5,22.75 37.55,22.64 37.8,22.33 U1.35 | C40.2 26.67,32.08 26.79,31.96 27.38,31.96 | 27.38,31.96 32.59,31.96 32.78,31.77 U1.57
  Top 0.254: 27.38,31.96 27.47,31.37 | 27.47,31.37 27.48,31.36 | v27.47,31.34 27.47,31.37
  Bottom 0.254: v48,36 48,35.02 47.22,34.24 EXP1.4 | v47.18,47.79 47.18,45.8 EXP2.4 | v39.5,54.5 38.58,54.5 v36.84,52.76 | v12.5,40.57 12.5,36 v13,35.5 | v28.5,54 28.5,56.5 28,57 28,61 v29,62 | v38.5,69 38.5,58.5 v39,58 | v41,95 41,87.5 38.5,85 38.5,75.12 v36.82,73.44
  pour Route15: 1,36 25,36 25,48.5 49,48.5 49,1 1,1
5V  (via drill 0.5)
  Top 0.254: TO_SENSOR.20 TO_SENSOR.1 28.68,45.98 v28.72,46.03 | 28.68,51.33 v28.5,51.5 | U3.3 48.84,98.4 49.09,98.15 49.09,93.09 48.5,92.5 47.58,92.5 C22.1 47.44,90.56 v47.5,90.5 | T1.2 1.22,27.68 0.86,28.04 0.86,33.36 1.24,33.74 R5.2 1.25,35.75 v1.5,36 | T3.2 4.1,40.35 R13.2 4.06,39.72 v4.72,39.06
  Bottom 0.254: v24.5,54.5 27.5,51.5 v28.5,51.5 28.72,51.28 v28.72,46.03 | v1.5,36 1.5,45 1.75,45.25 | v1.78,45.22 1.75,45.25 | v1.78,45.23 v1.78,45.22 | 1.75,45.25 1.75,45.26 | 1.75,45.25 1.75,45.19 1.79,45.19 1.79,45.2 1.81,45.18 | v1.78,45.22 1.78,45.21 1.8,45.21 1.8,45.18
  pour Route15 (rank 2): 49,88 49,106.5 1,106.5 1,95 1,36.5 24,36.5 24,45 24.5,45 24.5,88
ADC_SPI_EN  (via drill 0.5)
  Top 0.254: U1.28 34.77,21.77 v35,23.13 | v29,58 30.78,58 U8.5
  Route15 0.254: v34.5,53.17 34.5,57.5 34,58 v29,58
  Bottom 0.254: v35,23.13 35,26.67 37.01,28.74 37,41.36 38.48,42.84 38.48,45.58 39.97,47.07 39.97,49.53 38.5,51 36.5,51 v34.5,53.17
AGND  (via drill 0.5)
  Top 0.254: D1.1 35.13,50.4 34.03,51.5 v32.5,51.5 | R4.1 1.2,19.3 v1.5,19 | R12.1 2.05,38.95 v3,38 | T2.E 27.93,58.56 28.9,59.53 v28.9,60.4 v28.89,60.41 | U6.6 U6.5 29.23,64.28 28.5,65.01 C8.1 27.53,65.01 v26.68,65.86 v26.67,65.86 25.65,66.5 25.65,67.97 27.54,69.04 C12.2 32.23,69.04 U$11.2 | U$11.2 32.24,70.22 32.23,70.23 | U$11.2 33.47,69.03 33.5,69 | U2.4 U2.2 46.25,71.15 C37.1 46.24,67.79 45.57,67.12 C36.2 45.5,65.78 45.5,63.88 45.49,63.57 44.56,62.64 T4.E v44.11,62.64 44.14,62.64 | R20.1 40.21,91.29 40,91.5 39,91.5 v38.5,92 | T13.E 30.49,96.01 v29.5,97 | T12.E 31.36,105.64 v31.5,105.5 | U8.3 U8.4 35.56,58.29 v36.51,59.24 | v30.51,33.44 30.55,33.44 31.17,32.82 TO_SENSOR.11
  Route2 0.254: v32.5,51.5 32.35,51.35 32.35,35.28 v30.51,33.44
  Bottom 0.254: v1.5,19 1.5,23.76 2.48,25.24 2.48,34.66 3.91,36.09 | 3.91,36.09 5.8,37.98 5.8,42.22 4.25,43.77 4.25,43.86 v3.58,44.53 | v3,38 3,37 3.91,36.09
  other vias: 32.22,70.26
  pour Route2 (rank 2): 1,44 44.5,44 43.5,106.5 1,106.5 1,102 0.5,102
ANALOG_REFERENCE  (via drill 0.5)
  Top 0.203: 48,71.09 U2.3 | C36.1 48.37,67.53 v48.9,68.06 48.86,68.06 48.31,68.61 48.31,70.19
  Top 0.254: U6.4 U6.3 29.43,65.58 29,66 29,66.5 28.26,66.5 C8.2 | C8.2 28.21,66.71 | C8.2 27.47,66.71 v26.73,67.56 v26.74,67.56 | C12.1 v26.65,71.84 v26.64,71.85 | 48.37,71.34 U2.3 48.31,70.19 | R27.1 v34.54,76.63 | R19.2 42.37,82.07 v42.51,81.27 | R25.2 28.17,82.67 28,82.5 28,82 27.5,81.5 26.72,81.5 v26.33,81.11 | R30.2 42.96,87.84 v41.97,88.83
  pour Route15: 25,51.5 49,51.5 49,88.5 25.5,88.5 25.5,65.5 25,65.5
D_MINUS
  Top 0.254: U1.36 39.62,22.82 40.5,21.83 40.5,20.7 38,18.1 38,13.01 39.69,11.32 USB.2
D_PLUS
  Top 0.254: U1.37 39.88,23.33 41.05,21.95 41,20.5 40.95,20.4 40.09,19.4 38.49,17.8 38.49,13.79 40.06,12.12 USB.3
DAC_SPI1_EN  (via drill 0.5)
  Top 0.254: U1.1 25.88,28.82 24.3,30.4 24.3,45.8 26.5,48 26.5,51 28,52.5 v30,52.5 | v30,59.5 33,59.5 33.5,60 34.59,60 36.3,61.71 U6.9
  Bottom 0.254: v30,52.5 v30,59.5
DIRECTION  (via drill 0.5)
  Top 0.254: U1.60 v31.27,27.6 | v22.65,31.46 23.01,31.88 23.11,32.57 23.11,46.75 25.45,48.79 25.45,54.37 26.47,55.39 T2.C 26.14,56.36 v25.29,56.99 | v26.36,64.74 26.36,63.42 R7.1
  Route15 0.254: v31.27,27.6 31.26,29.44 30.25,30.05 29.75,30.25 28.5,30.3 27.75,29.25 25.5,29.25 24.75,30 23.79,30 v22.65,31.46
  Bottom 0.254: v25.29,56.99 25.29,59.29 26,60.5 26,64.38 v26.36,64.74
FLASH_SS  (via drill 0.5)
  Top 0.254: U1.13 26.24,22.84 25.62,22.24 25.23,21.87 24.47,21.11 24.47,19.97 23,18.5 v23,17.5 | U7.1 14.21,13.54 v14.21,15.71
  Bottom 0.254: v23,17.5 23,17 22,16 14.5,16 v14.21,15.71
GATE_OUT  (via drill 0.5)
  Top 0.254: U1.58 32.27,29.77 v33.04,27.91 | v14.49,30.28 14.29,30.41 10,35.5 6.5,35.5 4,38 4,38.47 2.75,39.72 2.75,39.99 2.34,40.4 R14.2
  Route15 0.254: v33.04,27.91 32.19,26.9 32.04,26.75 25.65,26.65 23.87,28.13 16.84,28.13 v14.49,30.28
GND  (via drill 0.5)
  Top 0.203: USB.5 40.11,14.39 40,14.5 40,15.01 v39.82,15.19
  Top 0.254: U1.20 30.79,19.85 30.79,18.18 31.29,17.66 C34.1 v31.29,15.05 v31.28,15.04 v31.29,15.04 | v34.5,15 34.71,15.21 C38.1 34.73,16.48 34.73,17.22 33.77,18.18 U1.26 | C39.1 46.42,19.33 v46.37,19.29 | v41.22,34.79 41.28,34.85 C30.2 43.34,37.92 C28.1 | v44.83,36.67 44.83,37.3 44.08,38.05 C28.1 | C28.1 43.22,38.77 43.86,39.41 U5.2 U5.4 | U1.9 26.02,24.83 25.46,25.67 C32.1 24.12,25.66 24.42,25.96 24.42,26.74 | 24.42,26.74 24.4,26.76 | C1.1 20.27,15.27 v19.5,14.5 18.5,13.5 18.04,13.5 U7.4 | v5.5,14 5.54,14.04 C44.1 5.77,15.5 11,15.5 11.56,14.94 U4.4 | R40.1 v22.49,5.51 v22.5,5.5 | C5.1 21.24,39.76 21.25,39.75 v21.24,39.74 v21.24,39.73 | C4.1 17.62,39.12 17.5,39 ENCODER.E | C33.1 23.28,22 | 23.28,22 23.29,22.01 | U3.4 45.5,104.49 45.5,104 45.61,103.89 U3.2 45.61,95.76 45.5,95.65 | 45.5,95.65 C19.1 44.64,94.64 44,94 44,93.21 C18.2 43.81,91.84 v44.76,91.37 | 45.5,95.65 47.23,95.65 C22.2 | U$11.1 34.81,69.03 C9.1 | C9.1 35.06,68.1 35.37,67.79 36.33,67.79 | C9.1 35.06,69.65 34.07,70.64 C13.2 | 36.33,67.79 36.31,67.48 U6.16 U6.15 U6.14 U6.13 | R39.1 v37.01,13.99 v37,14 | 24.42,26.74 24.41,26.74 v24.39,26.62 | 23.28,22 v23.28,22.03 v23.29,22.04 | 36.33,67.79 38.36,67.79 v39.35,66.8 | C23.2 C31.2 49.14,23.87 49.24,23.77 | U1.41 40.45,25.33 v41.2,26.08 41.2,26.76 42.53,28.09 48.78,28.09 49.24,27.63 49.24,23.77 | 49.24,23.77 49.24,21.3 48.57,20.63 42.47,20.63 42.15,21.87 42.16,23.38 41.96,23.87 40.73,23.86 | v26.22,34.85 v26.21,34.84 C40.1 26.33,33.5 27,33.5 27.17,33.33 27.17,33.15 27.5,32.82 TO_SENSOR.10 | C43.1 34.39,36 | 34.39,36 34.39,36.19 34.41,36.21 | v34.43,36.51 34.43,36.34 34.39,36
  Bottom 0.254: EXP2.1 43.92,37.58 v44.83,36.67 | POWER.P$12 43.58,66.8 44.2,66.92 | 44.2,66.92 46.42,66.92 46.5,67 46.8,67 | 46.8,67 POWER.P$11 POWER.P$13 | POWER.P$14 POWER.P$12 | v39.35,66.8 39.35,66.45 40.04,66.8 POWER.P$12 | POWER.P$12 POWER.P$10 | 46.8,67 46.8,69.14 POWER.P$9 47.64,69.98 48.22,69.98 49.29,71.05 49.29,81.85 44.76,87.24 v44.76,91.37 | 44.2,66.92 43.69,66.92 v44.18,66.91 | EXP1.1 43.92,23.2 46.36,20.76 46.36,20.11 v46.37,19.29
  pour Route2: 0.59,1 49,1 49,50.5 25.5,50.5 25.5,43 0.5,43
  pour Route2: 44.5,106.5 49,106.5 49,40 44.5,40
HOLD  (via drill 0.5)
  Top 0.254: v40.22,60.25 41.51,60.25 T4.C R17.1 | U1.55 33.77,29.13 34.1,28.8 34.1,28.2 35.4,26.9 36.4,26.9 v36.5,27
  Bottom 0.254: v36.5,27 36.5,27.06 37.64,28.2 37.64,41.05 39.06,42.47 39.06,45.21 40.48,46.63 40.48,59.99 v40.22,60.25
I2C1_SCL
  Top 0.254: U1.44 39.82,26.83 40.96,28.27 40.96,32.74 39.75,33.8 39.75,47 39,48 33.5,48 33,47.5 28.5,47.5 27,46 27,43.5 27.5,43 28.66,43 TO_SENSOR.2
I2C1_SDA  (via drill 0.5)
  Top 0.254: U1.43 40.03,26.33 41.5,28 41.5,33 40.25,34 40.25,47.6 39,48.8 35.06,48.81 35.06,48.94 v35,49 | v34.5,43 32.34,43 TO_SENSOR.19
  Bottom 0.254: v35,49 35,43.5 v34.5,43
I2C2_SCL  (via drill 0.5)
  Top 0.254: U1.32 36.77,21.23 v36,22 | v48.99,39.27 48.99,32.55 48,32 43.9,32 v42.31,30.05
  Bottom 0.203: v36,22 41.3,22 44.32,18.48 46.79,18.52 48.84,19.73 48.84,24.8
  Bottom 0.254: 48.84,24.8 48.84,28.08 48.37,28.55 EXP1.2 47.2,28.53 43.9,28.53 43.88,28.55 42.74,28.55 42.31,28.91 v42.31,30.05 | EXP2.2 48.32,40.68 49,40 49,39.72 v48.99,39.27
I2C2_SDA  (via drill 0.5)
  Top 0.254: U1.31 36.27,18.23 v36.5,17.5
  Bottom 0.203: v36.5,17.5 42.5,18 43.16,17.99 47.68,17.99 48.63,18.45 49.42,19.63
  Bottom 0.254: 49.42,19.63 49.42,21.6 49.41,23.47 49.41,29.08 48.55,29.94 44.41,29.94 43.92,30.43 EXP1.3 42.81,31.09 42.2,32.9 42.2,42.59 42.64,43.23 EXP2.3
LED_PWM_1  (via drill 0.5)
  Top 0.254: U1.49 36.77,38.73 36,39.5 v35,39.5 | v30.47,38.5 29.79,39.18 TO_SENSOR.5
  Bottom 0.254: v35,39.5 31.47,39.5 v30.47,38.5
LED_PWM_2
  Top 0.254: 32.37,39.13 TO_SENSOR.16 33.61,39.17 34,39.56 34,40 34.5,40.5 36,40.5 38,38.5 38,32.5 38.72,31.78 U1.48
LED_PWM_3  (via drill 0.5)
  Top 0.254: U1.51 35.77,37.99 35.72,38.04 35.13,38.04 v34.96,38.18 | v26.6,37.7 28.46,37.73 28.55,37.89 28.66,37.89 TO_SENSOR.6
  Bottom 0.254: v34.96,38.18 32.48,38.28 31.5,37 27.5,37 v26.6,37.7
LED_PWM_4
  Top 0.254: U1.52 35.26,36.98 35.24,37.29 34.2,37.48 33.48,37.9 TO_SENSOR.15
LED_PWM_5  (via drill 0.5)
  Top 0.254: U1.53 34.77,28.73 v35,28.5 | v26.5,36.5 27.24,36.5 27.35,36.61 28.66,36.61 TO_SENSOR.7
  Bottom 0.254: v35,28.5 35,34.5 34,35.5 27.5,35.5 v26.5,36.5
LOOP_SYNC  (via drill 0.5)
  Top 0.254: U1.61 30.76,28.85 v30.36,28.26 | R6.2 5.06,29.06 5.12,29 15,29 15.7,29.9 20.7,29.9 21.12,29.28 v21.68,29.28
  Route15 0.254: v30.36,28.26 30.05,27.25 25.85,27.25 24.25,28.75 22.21,28.75 v21.68,29.28
MCLR
  Top 0.254: U$4.6 26.1,18.41 29.8,22 29.81,25.1 28.67,25.82 27.36,25.83 U1.7 26.22,25.83 25.64,26.75 25.57,26.84 24.49,27.92 R16.1
MGC3130_IRQ  (via drill 0.5)
  Top 0.254: U1.46 39.93,27.83 40.4,28.5 40.4,32.5 39.25,33.5 39.25,46 38.5,47 v36,47 | v34.77,41.7 TO_SENSOR.18
  Bottom 0.254: v36,47 36,42.93 v34.77,41.7
MGC3130_RESET  (via drill 0.5)
  Top 0.254: U1.47 39.66,28.33 39.9,28.77 39.9,32 38.75,33 38.75,45.5 38.5,46 v30.5,46 | v30.41,41.72 TO_SENSOR.3
  Bottom 0.254: v30.5,46 30.5,42.63 v30.41,41.72
N$1
  Top 0.254: T1.3 3.15,27.35 3,27.5 2.16,27.5 1.87,28.25 R6.1 1.87,31.2 2.97,32.97 2.97,34.45 R5.1
N$2
  Top 0.254: IC1.2 29.1,85.75 C2.2 | C2.2 26.53,85.9 R23.1 | C2.2 28.95,84.42 R25.1
N$4
  Top 0.254: IC1.1 30.48,87.02 30,87.5 29.05,87.5 C2.1 | C2.1 28.95,89.07 R24.1 | C2.1 26.53,87.6 R23.2
N$5
  Top 0.254: R4.2 2.9,21.1 2,22 1.57,22 1.27,22.3 R3.1 1.27,23.54 2.19,24.45 T1.1
N$6  (via drill 0.5)
  Top 0.254: R3.2 2.96,23.96 v3.5,24.5
  Bottom 0.203: 3.5,34.5 3.5,34 3,33.5 3,25 v3.5,24.5
  Bottom 0.254: 3.5,34.5 6.5,37.5 JACK1.3
N$7  (via drill 0.5)
  Top 0.254: IC1.5 v34.26,81.94 v34.27,81.95 | v32,66 31.85,66 31.64,66.21 30.52,66.21 U6.2
  Bottom 0.254: v34.27,81.95 31.95,81.95 31,81 31,69.5 31.5,69 31.5,67.5 32,67 v32,66
N$8
  Top 0.254: JACK2.3 19,50 22,53 22,58 24.5,60.5 25.78,60.5 R8.1
N$9
  Top 0.254: R8.2 27.61,60.61 26.5,59.5 26,59.5 25.5,59 25.5,58.58 T2.B
N$11
  Top 0.254: R27.2 31.56,77.41 32.15,78 33.5,78 34.5,79 34.5,80 33.83,80.67 IC1.6 31.07,80.67 30.46,81.28 28.15,81.28 27.67,80.8 C3.2 R26.2
N$12
  Top 0.254: R14.1 R13.1 5.69,42.09 T3.3
N$13  (via drill 0.5)
  Top 0.254: R12.2 1.73,37.12 v2.77,36.08 | v7.9,40.2 7.9,41.3 T3.1 8.06,41.17 R11.1
  Route15 0.254: v2.77,36.08 3.78,36.08 v7.9,40.2
N$14
  Top 0.254: R11.2 9.59,47.41 7.5,49.5 7.5,51 9.5,53 9.5,54.85 JACK3.3
N$15
  Top 0.254: IC1.7 31.13,79.4 30.19,80.34 C3.1 R26.1 29.37,74.66 R28.1
N$16
  Top 0.254: R18.2 40.79,62.68 T4.B
N$17
  Top 0.254: R16.2 21.56,25.68 C32.2 R15.1
N$18  (via drill 0.5)
  Top 0.254: R18.1 40.79,66.96 39.43,67.76 39.44,69.45 v38.61,70.24 | v31.95,73.21 25.21,73.21 22.5,70.5 19.15,70.5 JACK4.3
  Bottom 0.254: v38.61,70.24 35.12,70.25 v31.95,73.21
N$19
  Top 0.254: C20.2 35.55,87.26 36.22,85.76 IC1.13 37.76,85.63 R29.1 41.6,86.14 R30.1
N$20  (via drill 0.5)
  Top 0.254: R10.1 11.3,42.48 11.3,43.08 11.5,43.25 20.27,43.24 20.76,42.78 C5.2 21.26,42.76 21.86,42.76 22.5,42.12 22.5,39.5 22,39 v22,34.5 | U1.64 28.78,30.78 28,30 26.7,30 v26.2,30.7
  Route15 0.254: v26.2,30.7 25.1,30.9 22.5,33.5 22.5,34 v22,34.5
  Bottom 0.254: ENCODER.B 14.75,21.5 17.5,24.25 17.5,25.75 13.5,29.75 13.5,31.5 16.75,34.75 21.75,34.75 v22,34.5
N$21
  Top 0.254: R29.2 39.83,87.33 39.5,87 37.66,87 IC1.14 37.64,88.73 R31.1 37.26,88.74 36.5,89.5 36.5,90 36,90.5 C20.1
N$22  (via drill 0.5)
  Top 0.203: C6.2 36.15,77.85 v35.5,78.5
  Top 0.254: R1.1 37.86,80.45 IC1.9 35.67,80.67 35.5,80.5 v35.5,78.5 | R35.2 26.38,84.5 26,84.5 24.5,83 v24.5,79.5
  Bottom 0.254: v35.5,78.5 35.5,83.5 33.5,85.5 29,85.5 28,84.5 28,78.75 26.33,78.58 25.42,78.58 v24.5,79.5
N$23  (via drill 0.5)
  Top 0.254: IC1.3 30.52,84.48 v30.5,84.5 | v30.5,68 U6.1
  Bottom 0.254: v30.5,84.5 v30.5,68
N$24  (via drill 0.5)
  Top 0.254: U8.2 37,55.52 | 37,55.52 37.98,55.52 38.5,55 D1.3 | R2.1 41.03,72.53 42.06,70.7 42.06,65.63 v43.68,64.81 | v37.5,56.5 37.5,56.02 37,55.52
  Route15 0.254: v37.5,56.5 38,56 43,56 43.68,56.68 43.68,58.32 42.5,59.5 42.5,63.63 v43.68,64.81
N$25  (via drill 0.5)
  Top 0.254: R24.2 28.41,90.83 v27,90 | v23,96.5 22.5,96.5 20.5,98.5 17.5,98.5 14.5,95.5 6.65,95.5 JACK6.3
  Route15 0.254: v27,90 26,90 23,93 v23,96.5
N$26  (via drill 0.5)
  Top 0.254: R35.1 26.16,82.66 25.5,82 25.5,74.98 v26.35,74.1 | v26.45,69.81 26.31,69.81 21,64.5 21,64 19,62 JACK5.3
  Bottom 0.254: v26.35,74.1 26.38,73.66 27.97,72.07 27.97,71.33 v26.45,69.81
N$27
  Top 0.203: C6.1 37.85,78.6 38,78.75
  Top 0.254: IC1.8 37.64,78.84 37.73,78.75 38,78.75 R1.2 41.05,77.17 R2.2
N$28  (via drill 0.5)
  Top 0.254: IC1.10 37.7,82 39.5,82 40,82.5 40,83 40.77,83.77 R19.1 41.34,83.5 41.5,83.5 v42.5,84.5 | R20.2 40.25,88.75 41.5,90 43,90 v43.5,89.5
  Bottom 0.254: v43.5,89.5 43.5,85.5 v42.5,84.5
N$29  (via drill 0.5)
  Top 0.254: R9.1 C4.2 19.33,38.87 20,38.2 v20,36 | U1.63 29.77,29.77 v28.93,29.23
  Route15 0.254: v20,36 17.75,36 15,33.25 15,31 17.25,28.85 19.55,28.85 v19.6,29 21.1,30.1 22.4,30.1 23.25,29.25 24.5,29.25 25.5,28.25 28,28.25 28.93,29.18 v28.93,29.23
  Bottom 0.254: ENCODER.A 7.75,26.75 17,36 v20,36
N$30
  Top 0.254: R37.1 25.77,97.77 23,95 19.35,95 JACK7.3
N$31  (via drill 0.5)
  Top 0.254: R28.2 27.58,75.92 v27.5,76
  Route15 0.254: v27.5,76 26.5,76 24.5,78 22,78 20,76 17.5,76 v16.5,77
  Bottom 0.254: v16.5,77 16,77 11.5,81.5 11.5,81.52 10.08,82.94 6.59,82.94 JACK9.3
N$32
  Top 0.254: T12.B 25.83,105.64 R37.2
N$33  (via drill 0.5)
  Top 0.254: U1.27 34.27,21.73 v34,22
  Route15 0.254: v34,22 30,22 29,21 20.5,21 18.5,23 14.5,23 v14,23.5
  Bottom 0.254: v14,23.5 14,23.75 POT.2
N$34  (via drill 0.5)
  Top 0.254: IC1.12 38.98,84.48 v39.64,84.82 | v32.5,63 30.54,63 U6.7
  Route15 0.254: v39.64,84.82 38.5,84.82 37,83.5 37,75.5 35.5,74 35.5,66 v32.5,63
N$35  (via drill 0.5)
  Top 0.254: U1.18 29.77,18.27 v27.46,16.41 | v21.15,2.18 U$2.3
  Bottom 0.254: v27.46,16.41 26,16.41 24,14.5 24,5.03 v21.15,2.18
N$37
  Top 0.254: R21.1 14.46,41.46 12.5,39 ENCODER.D
N$38  (via drill 0.5)
  Top 0.254: R31.2 37.88,91.12 v37,92 | v17.5,86 17.5,85.67 8.01,76.18 8.01,75.65 6.46,74.1 6.46,70.39 JACK10.3
  Route15 0.203: 26,89 28,89 28.5,89.5 28.5,90.5 v27.5,91.5
  Route15 0.254: 26,89 24.5,90.5 22.5,90.5 21,89 20.5,89 v17.5,86
  Bottom 0.254: v37,92 28,92 v27.5,91.5
N$39
  Top 0.254: R83.1 25.58,93.58 19,87 JACK8.3
N$40
  Top 0.254: T13.B 26.01,95.34 R83.2
N$41
  Top 0.254: C23.1 47.5,27 47,26.5 47,25.5 46.5,25 43.69,25 43.27,25.42 | 43.27,25.42 43.27,26.56 CRYSTAL.3 | U1.40 42.68,24.83 43.27,25.42
N$42  (via drill 0.5)
  Top 0.254: v44.5,80.5 44.5,81.98 F1.1
  Bottom 0.254: POWER.P$7 44.52,71.88 44.3,72.1 | 44.3,72.1 44.3,80.3 v44.5,80.5 | POWER.P$8 44.08,71.88 44.3,72.1
N$43
  Top 0.254: U1.39 44.67,24.33 45.5,23.5 45.5,22.33 CRYSTAL.1 45.66,22.17 C31.1
N$44  (via drill 0.5)
  Top 0.254: v48.5,80.98 48,81 47.5,81.5 47.5,82.08 F2.1
  Route2 0.254: v49,62 48.07,67.27 48,69 48,69.5 49,70.5 49,80.5 v48.5,80.98
  Bottom 0.254: v49,62 48.72,61.72 POWER.P$15 42.22,61.72 42,61.5 41.76,61.5 POWER.P$16
N$45
  Top 0.254: R38.1 R39.2 35.31,11.55 36.34,10.52 USB.1
N$46
  Top 0.254: C43.2 34.39,32.68 33.7,31.99 33.41,31.99 33.27,31.85 U1.56
N$47
  Top 0.254: U1.34 37.83,21.83 37.5,21.5 37.5,16.5 35,14 32.5,14 31.5,13 31.5,12.41 R38.2
N$50  (via drill 0.5)
  Top 0.254: v38.71,20.36 38.72,21.2 U1.33 | v40.81,18.72 40.52,19.02 39,17.5 39,14 40,13 41.27,13 USB.4
  Bottom 0.254: v40.81,18.72 39,20 v38.71,20.36
N$51
  Top 0.254: R41.2 20.88,8.88 20.5,8.5 7.81,8.5 U$2.2
PGEC
  Top 0.254: U1.15 26.39,21.82 26.05,21.5 25.04,19.8 23.91,18.22 23.91,6.47 U$4.2
PGED
  Top 0.254: U1.16 27.32,20.68 24.54,17.9 24.54,8.38 U$4.3
RAM_SS  (via drill 0.5)
  Top 0.203: U1.21 31.27,18.44 v32.12,17.89 | v13.5,10 9.55,10 7.75,11.8 U4.1
  Route2 0.203: v32.12,17.89 29.57,17.89 28.98,17.24 26.77,17.24 25.43,15.96 25.43,15.93 24,14.5 24,11.5 22,9.5 14,9.5 v13.5,10
RECORD_IN  (via drill 0.5)
  Top 0.254: T12.C 28.55,103.44 27.27,102.16 27.27,100.88 R36.1 27.5,100.65 v27.5,99 | U1.62 30.27,29.49 v29.13,28.05 | v25.17,32.77 25.17,37.33 25.1,37.5 v25.1,44.9
  Bottom 0.254: v29.13,28.05 27.02,28.05 24.73,30.54 24.73,32.33 v25.17,32.77 | v25.1,44.9 21,49 21,52 22,53 22,59.5 20.5,61 20.5,64.5 22,66 22,72 20.5,73.5 20.5,76.5 22,78 22,84.5 20.5,86 20.5,88.5 22,90 22,93.5 v27.5,99
SPI1_CLK  (via drill 0.5)
  Top 0.254: U1.50 36.27,29.63 v36.11,29.07 | v33,53.5 33,55 32.5,55.5 30.85,55.5 U8.7 | U6.10 35.48,62.98 v33.5,61
  Bottom 0.254: v36.11,29.07 36.14,41.75 38,43.5 38,46 39.5,47.5 39.5,49 39,49.5 37,49.5 v33,53.5 33.5,54 v33.5,61
SPI1_MOSI
  Top 0.254: 36.33,63.64 U6.11 37.17,63.62 37.5,63.29 37.5,61.5 35.5,59.5 34,59.5 32.28,56.78 U8.6 29.79,56.78 26,53 26,48.35 23.72,46.21 23.69,29.75 25,28.5 25.3,28.1 26.44,26.81 U1.5
SPI2_MISO  (via drill 0.5)
  Top 0.254: U4.2 9.03,11.97 9.5,11.5 15,11.5 15.25,11.75 | 15.25,11.75 15.5,12 15.5,13.49 U7.2 | U1.6 28.82,26.33 v30.7,25.3 | v15.5,10.5 15.5,11.5 15.25,11.75
  Bottom 0.254: v30.7,25.3 30.6,23 27.5,20 26.81,20 20.04,13.23 20.04,12.54 18,10.5 v15.5,10.5
SPI2_MOSI  (via drill 0.5)
  Top 0.254: U1.14 28.44,22.33 v28.95,22.84 | v20,19.5 18.19,19.5 18.04,19.35 18.04,18.77 U7.5 | U4.5 11.56,17.43 v12,16.74
  Bottom 0.254: v28.95,22.84 27.34,22.84 23.5,19 20.5,19 v20,19.5 14,19.5 12,17.5 v12,16.74
SPI2_SCK  (via drill 0.5)
  Top 0.254: v19.5,27 19.5,21.14 18.62,20.26 17.02,20.26 16.81,20.05 | 16.81,20.05 16.73,19.97 U7.6 | U4.6 10.29,19.95 10.57,20.23 16.63,20.23 16.81,20.05 | U1.4 28.17,27.33 30,26.3 31.02,26.3 v31.94,25.58
  Route15 0.254: v19.5,27 22.5,27 24,25.5 29,25.5 29.9,26.2 31.22,26.2 v31.94,25.58
SR_CLK  (via drill 0.5)
  Top 0.254: TO_SENSOR.17 31.11,40.44 v30.48,39.81 | v29,24.5 29,24.09 28.24,23.33 U1.12
  Bottom 0.254: v30.48,39.81 27.4,39.81 27.09,39.8 25,39.8 24,38.5 24,28.36 25.53,26.83 25.53,24.47 26.5,23.5 28,23.5 v29,24.5
SR_DATA  (via drill 0.5)
  Top 0.254: v24.43,22.36 24.43,22.39 25.57,23.83 U1.11 | TO_SENSOR.4 28.61,40.5 27.2,40.5 v26.8,40.9
  Bottom 0.254: v24.43,22.36 23.5,23.19 23.5,41 23.85,41.35 25.65,41.35 v26.8,40.9
SWITCH_INPUT  (via drill 0.5)
  Top 0.254: U1.45 37.8,27.33 37.51,27.17 37.5,26 36,24.5 33,24.5 v31.5,23 | U$2.4 14.4,2.19 19.41,7.2 R40.2 21,7.29 21,8 21.5,8.5 v22,8.5
  Bottom 0.254: v31.5,23 27.5,19 26.7,19 24.72,17.02 24.72,17.01 22.38,14.67 22.17,14.67 21.5,14 21.5,9 v22,8.5
SWITCH_LED1  (via drill 0.5)
  Top 0.254: U1.17 29.27,19.77 v27.5,18 | v22.51,13.78 20.9,13.78 R41.1
  Bottom 0.254: v27.5,18 26.6,18 v22.51,13.78
SYNC_IN  (via drill 0.5)
  Top 0.254: R82.1 T13.C 29.4,93 v27.5,93 | U1.59 31.77,29.43 32,28 32.4,27.2 v33.1,26 | v26,38.8 26,46.1 27,47.5 27,50 v27.5,50.5
  Bottom 0.254: v33.1,26 33.5,26.5 34,27 34,34 33.5,34.5 27.5,34.5 27,34 25.5,34 25,34.5 25,38 v26,38.8 | v27.5,50.5 26.5,50.5 23.5,53.5 23.5,59.5 25.5,61.5 25.5,76.5 23.5,78.5 23.5,83.5 26.5,86.5 26.5,88.5 26,89 26,91.5 v27.5,93
VCC  (via drill 0.5)
  Top 0.254: C28.2 41.52,40.85 U5.1 41.55,44.45 41,45 41,48.5 42,49.5 v44,49.5 | U3.1 43.3,96.01 C19.2 42.94,94.44 42.5,94 42.5,93.5 42,93 | 42,93 C18.1 36.51,93.01 35.5,92 32.71,92 31.68,90.97 31.68,89.24 C24.2 31.65,88.85 32.5,88 33.5,88 34,87.5 34,83.28 33.96,83.24 32.47,83.24 IC1.4 | 42,93 42.02,91.37 43.06,90.56 44.56,90.56 45.09,88.91 C25.2 45,87.85 45,87 44.47,86.47 F1.2 44.46,84.82 43.44,84.82 43.38,84.04 43.33,76.29 43.69,75.3 U2.1 43.7,69.94 44.55,69.09 C37.2 44.52,68.56 v43.29,68.07
  Route15 0.254: v47.5,58.5 47.5,66.5 45.5,68.5 43.41,68.5 v43.29,68.07
  Bottom 0.254: v44,49.5 44,55 v47.5,58.5
VEE  (via drill 0.5)
  Top 0.254: C25.1 47,87.73 47,87 47.57,86.43 F2.2 47.57,83.92 47.28,83.63 46.25,83.63 v46.23,83.65 | v39.47,83.65 39.47,83.51 39.17,83.21 IC1.11 36.29,83.21 36,83.5 36,85.05 34.57,87.05 34.57,88.19 33.36,88.55 C24.1
  Bottom 0.254: v46.23,83.65 v39.47,83.65